# Altium project PiMX8MP_r0.3_release.PrjPcb (part 4 of 6)

## Sheet 11_WIFI_BLE_Module.SchDoc: WIFI_BLE_Module
size 420 x 297 mm; Author: Lukas Henkel; DocumentNumber: 11; SheetNumber: 11; SheetTotal: 16; DocSize: A3
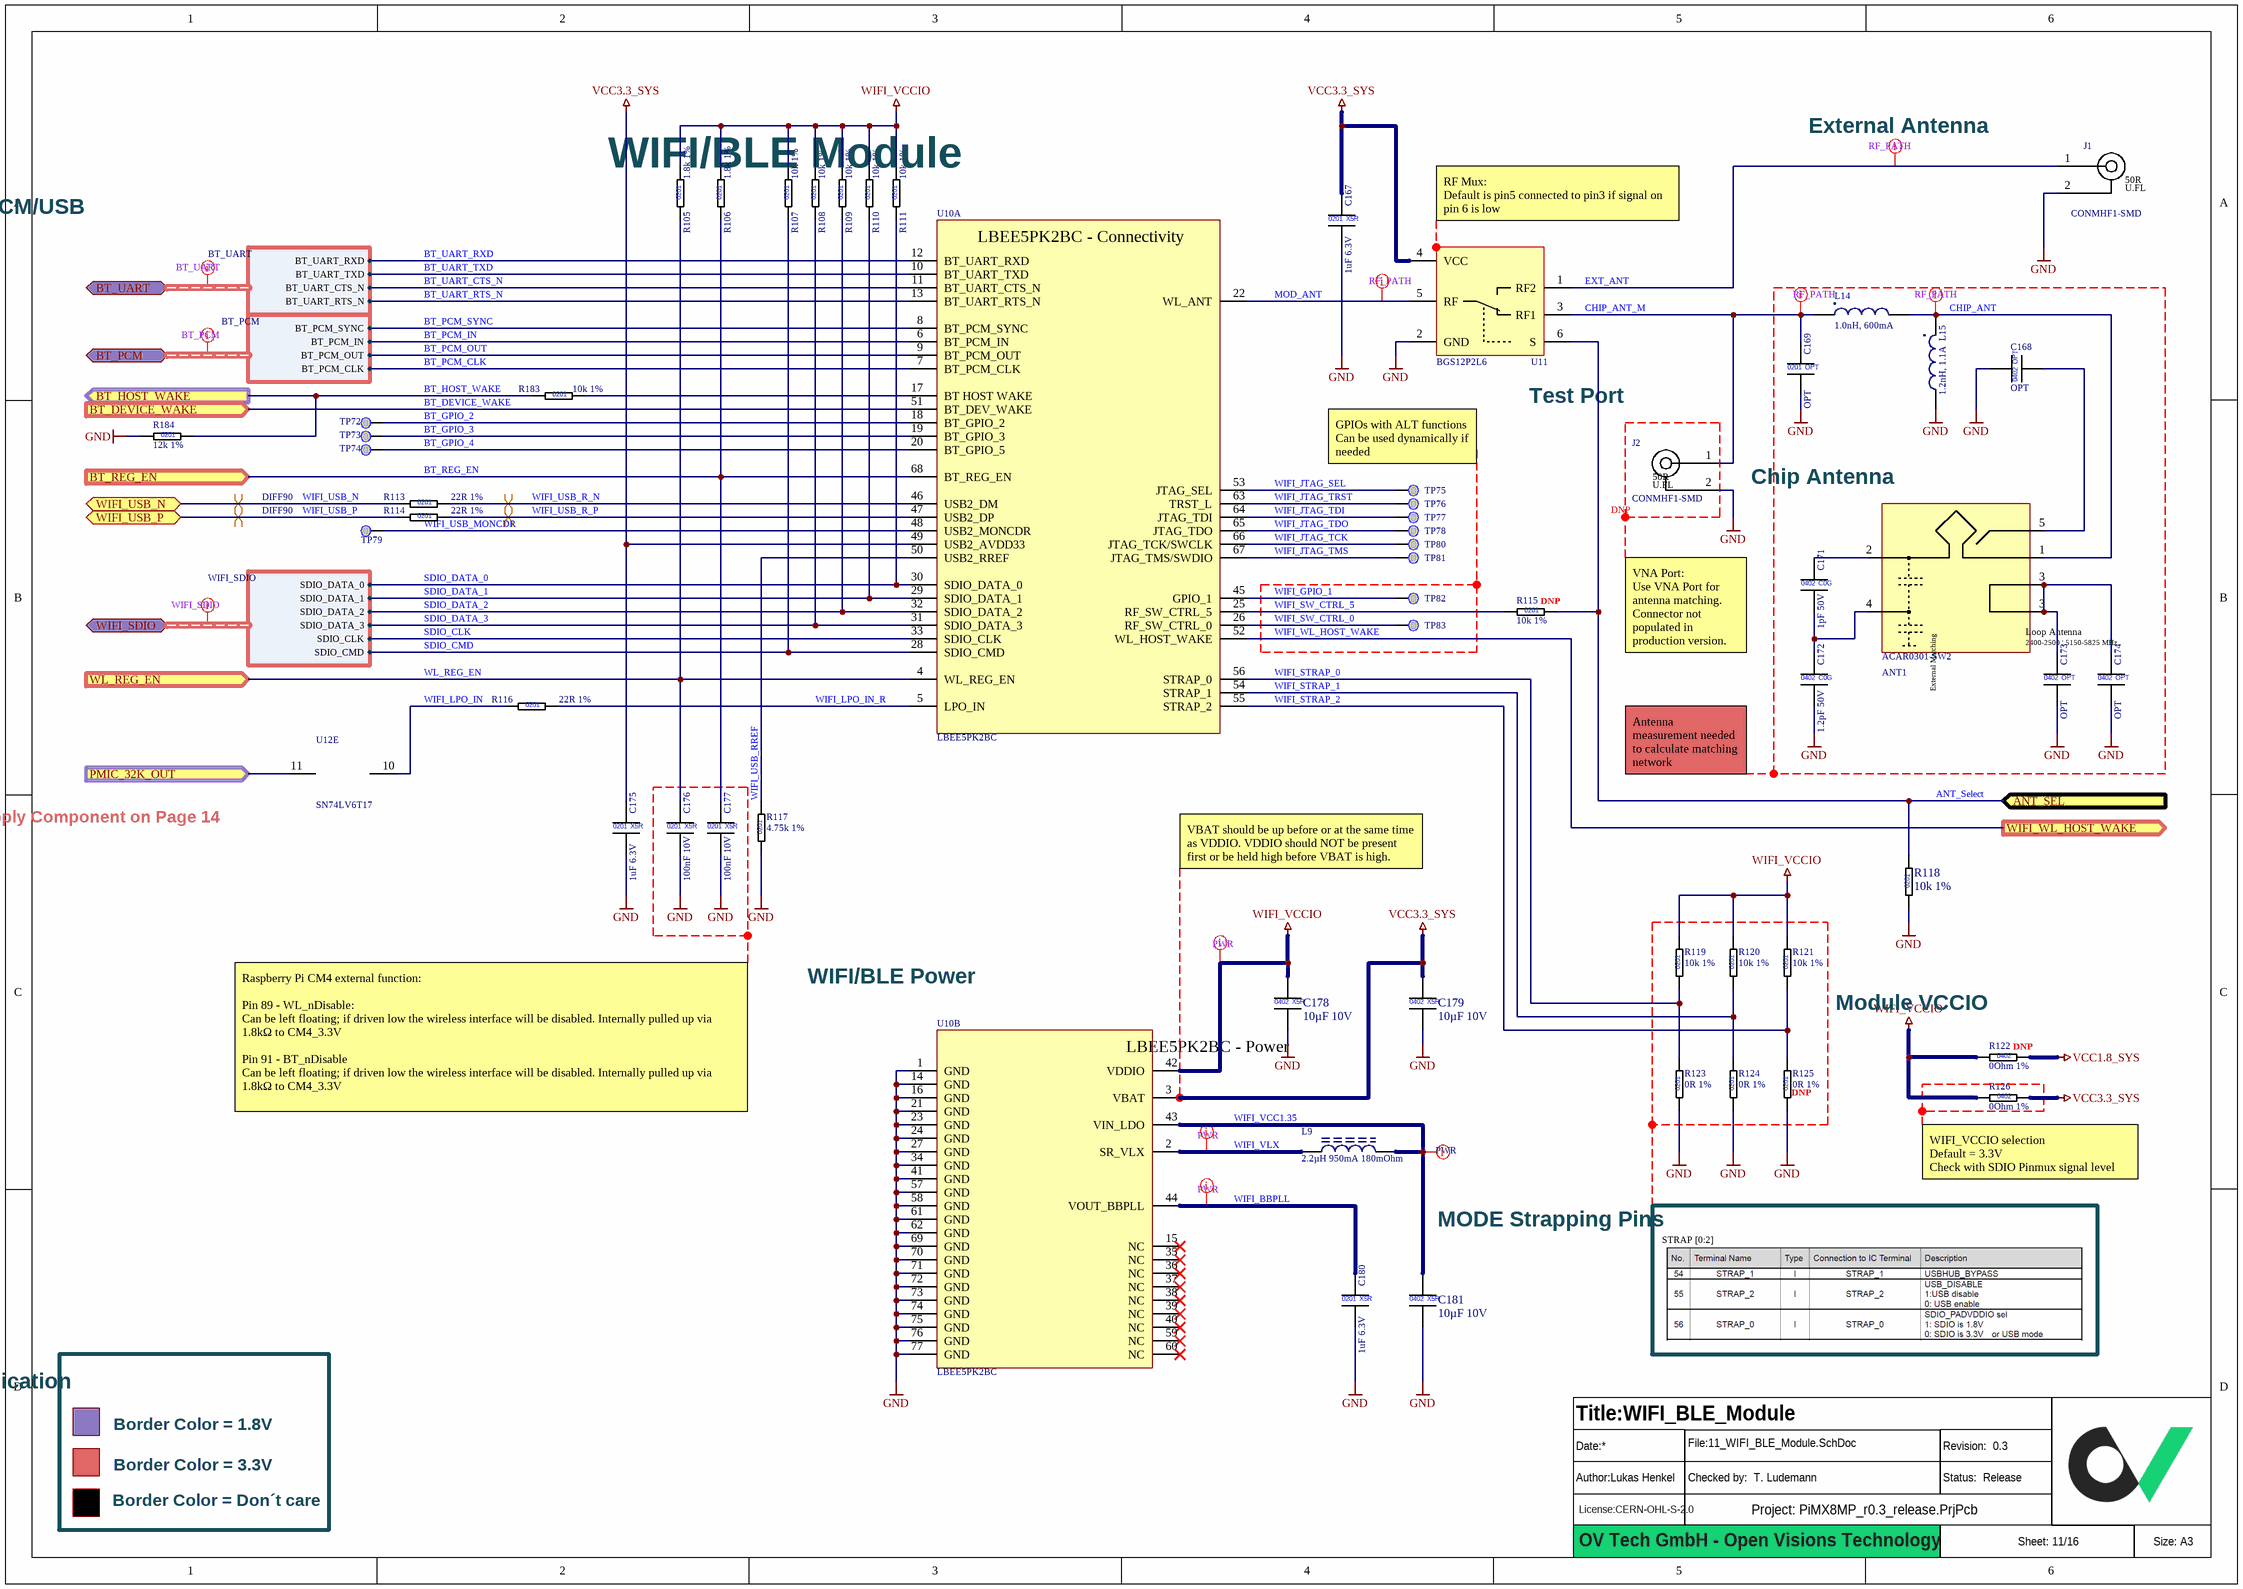
[diagram p11: 11_WIFI_BLE_Module.SchDoc]

### Parts
(Parts that share a designator on the sheet are numbered #1, #2 ... from top to bottom, then left to right.)
?#11  (no value)  (graphical)
ANT1  ACAR0301-SW2  [ANTENNA_ACAR0301-SW2]
C167  1uF 6.3V  [CAPC0603X03L]
C168  OPT  [CAPC1005X06L]  (no BOM)
C169  OPT  [CAPC0603X03L]  (no BOM)
C171  1pF 50V  [CAPC1005X06L]
C172  1.2pF 50V  [CAPC1005X06L]
C173  OPT  [CAPC1005X06L]  (no BOM)
C174  OPT  [CAPC1005X06L]  (no BOM)
C175  1uF 6.3V  [CAPC0603X03L]
C176  100nF 10V  [CAPC0603X03L]
C177  100nF 10V  [CAPC0603X03L]
C178  10µF 10V  [CAPC1005X06L]
C179  10µF 10V  [CAPC1005X06L]
C180  1uF 6.3V  [CAPC0603X03L]
C181  10µF 10V  [CAPC1005X06L]
J1  CONMHF1-SMD  [U.FL Jack SMD]
J2  CONMHF1-SMD  [U.FL Jack SMD]  (no BOM)
L9  2.2µH 950mA 180mOhm  [INDC2012X10L]
L14  1.0nH, 600mA  [INDC0603X03L]
L15  1.2nH, 1.1A  [INDC0603X03L]
R105  1.8k 1%  [RESC0603X03L]
R106  1.8k 1%  [RESC0603X03L]
R107  10k 1%  [RESC0603X03L]
R108  10k 1%  [RESC0603X03L]
R109  10k 1%  [RESC0603X03L]
R110  10k 1%  [RESC0603X03L]
R111  10k 1%  [RESC0603X03L]
R113  22R 1%  [RESC0603X03L]
R114  22R 1%  [RESC0603X03L]
R115  10k 1%  [RESC0603X03L]
R116  22R 1%  [RESC0603X03L]
R117  4.75k 1%  [RESC0603X03L]
R118  10k 1%  [RESC0603X03L]
R119  10k 1%  [RESC0603X03L]
R120  10k 1%  [RESC0603X03L]
R121  10k 1%  [RESC0603X03L]
R122  0Ohm 1%  [RESC1005X04L]
R123  0R 1%  [RESC0603X03L]
R124  0R 1%  [RESC0603X03L]
R125  0R 1%  [RESC0603X03L]
R126  0Ohm 1%  [RESC1005X04L]
R183  10k 1%  [RESC0603X03L]
R184  12k 1%  [RESC0603X03L]
TP72  Testpoint 0.5mm  [TP_0.50mm]  (value not drawn)  (no BOM)
TP73  Testpoint 0.5mm  [TP_0.50mm]  (value not drawn)  (no BOM)
TP74  Testpoint 0.5mm  [TP_0.50mm]  (value not drawn)  (no BOM)
TP75  Testpoint 0.5mm  [TP_0.50mm]  (value not drawn)  (no BOM)
TP76  Testpoint 0.5mm  [TP_0.50mm]  (value not drawn)  (no BOM)
TP77  Testpoint 0.5mm  [TP_0.50mm]  (value not drawn)  (no BOM)
TP78  Testpoint 0.5mm  [TP_0.50mm]  (value not drawn)  (no BOM)
TP79  Testpoint 0.5mm  [TP_0.50mm]  (value not drawn)  (no BOM)
TP80  Testpoint 0.5mm  [TP_0.50mm]  (value not drawn)  (no BOM)
TP81  Testpoint 0.5mm  [TP_0.50mm]  (value not drawn)  (no BOM)
TP82  Testpoint 0.5mm  [TP_0.50mm]  (value not drawn)  (no BOM)
TP83  Testpoint 0.5mm  [TP_0.50mm]  (value not drawn)  (no BOM)
U10  LBEE5PK2BC  [WIFI-BLE Module_LBEE5PK2BC]  (parts A,B of 2)
U11  BGS12P2L6  [PSON40P70X32-6N]
U12  SN74LV6T17  [QFN50P250X300X80_HS-13L]  (part E of 7)

### Blocks framed on the sheet
Chip Antenna: ANT1 C168 C169 C171-C174 L14 L15
DNP: J2
DNP: R119-R121 R123-R125

### Ports
ANT_SEL (in), BT_DEVICE_WAKE (in), BT_HOST_WAKE (out), BT_PCM (bidir, harness BT_PCM), BT_REG_EN (in), BT_UART (bidir, harness BT_UART), PMIC_32K_OUT (in), WIFI_SDIO (bidir, harness WIFI_SDIO), WIFI_USB_N (bidir), WIFI_USB_P (bidir), WIFI_WL_HOST_WAKE (out), WL_REG_EN (in)

### Harnesses
BT_UART: BT_UART_TXD, BT_UART_RXD, BT_UART_RTS_N, BT_UART_CTS_N
BT_PCM: BT_PCM_SYNC, BT_PCM_IN, BT_PCM_OUT, BT_PCM_CLK
WIFI_SDIO: SDIO_DATA_1, SDIO_DATA_0, SDIO_DATA_3, SDIO_DATA_2, SDIO_CMD, SDIO_CLK

### Nets
GND: C167.2 C168.1 C169.2 C172.2 C173.2 C174.2 C175.2 C176.2 C177.2 C178.2 C179.2 C180.2 C181.2 J1.2 J2.2 L15.2 R117.1 R118.1 R123.1 R124.1 R125.1 R184.1 U10.1(GND) U10.14(GND) U10.16(GND) U10.21(GND) U10.23(GND) U10.24(GND) U10.27(GND) U10.34(GND) U10.41(GND) U10.57(GND) U10.58(GND) U10.61(GND) U10.62(GND) U10.69(GND) U10.70(GND) U10.71(GND) U10.72(GND) U10.73(GND) U10.74(GND) U10.75(GND) U10.76(GND) U10.77(GND) U11.2(GND)
VCC1.8_SYS: R122.2
VCC3.3_SYS: C167.1 C175.1 C179.1 R126.2 U10.3(VBAT) U10.49(USB2_AVDD33) U11.4(VCC)
WIFI_VCCIO: C178.1 R105.2 R106.2 R107.2 R108.2 R109.2 R110.2 R111.2 R119.2 R120.2 R121.2 R122.1 R126.1 U10.42(VDDIO)
ANT_Select: R115.2 R118.2 U11.6(S) ; port ANT_SEL  [project net ANT_SEL]
BT_DEVICE_WAKE: U10.51(BT_DEV_WAKE) ; port BT_DEVICE_WAKE
BT_GPIO_2: TP72.TP U10.18(BT_GPIO_2)
BT_GPIO_3: TP73.TP U10.19(BT_GPIO_3)
BT_GPIO_4: TP74.TP U10.20(BT_GPIO_5)
BT_HOST_WAKE: R183.1 R184.2 ; port BT_HOST_WAKE
BT_PCM_CLK: U10.7(BT_PCM_CLK) ; port BT_PCM.BT_PCM_CLK
BT_PCM_IN: U10.6(BT_PCM_IN) ; port BT_PCM.BT_PCM_IN
BT_PCM_OUT: U10.9(BT_PCM_OUT) ; port BT_PCM.BT_PCM_OUT
BT_PCM_SYNC: U10.8(BT_PCM_SYNC) ; port BT_PCM.BT_PCM_SYNC
BT_REG_EN: C177.1 R106.1 U10.68(BT_REG_EN) ; port BT_REG_EN
BT_UART_CTS_N: U10.11(BT_UART_CTS_N) ; port BT_UART.BT_UART_CTS_N
BT_UART_RTS_N: U10.13(BT_UART_RTS_N) ; port BT_UART.BT_UART_RTS_N
BT_UART_RXD: U10.12(BT_UART_RXD) ; port BT_UART.BT_UART_RXD
BT_UART_TXD: U10.10(BT_UART_TXD) ; port BT_UART.BT_UART_TXD
CHIP_ANT: ANT1.1 L14.2 L15.1
CHIP_ANT_M: C169.1 J2.1 L14.1 U11.3(RF1)
EXT_ANT: J1.1 U11.1(RF2)
MOD_ANT: U10.22(WL_ANT) U11.5(RF)
PMIC_32K_OUT: U12.11(5A) ; port PMIC_32K_OUT
SDIO_CLK: U10.33(SDIO_CLK) ; port WIFI_SDIO.SDIO_CLK
SDIO_CMD: R107.1 U10.28(SDIO_CMD) ; port WIFI_SDIO.SDIO_CMD
SDIO_DATA_0: R111.1 U10.30(SDIO_DATA_0) ; port WIFI_SDIO.SDIO_DATA_0
SDIO_DATA_1: R110.1 U10.29(SDIO_DATA_1) ; port WIFI_SDIO.SDIO_DATA_1
SDIO_DATA_2: R109.1 U10.32(SDIO_DATA_2) ; port WIFI_SDIO.SDIO_DATA_2
SDIO_DATA_3: R108.1 U10.31(SDIO_DATA_3) ; port WIFI_SDIO.SDIO_DATA_3
WIFI_BBPLL: C180.1 U10.44(VOUT_BBPLL)
WIFI_GPIO_1: TP82.TP U10.45(GPIO_1)
WIFI_JTAG_SEL: TP75.TP U10.53(JTAG_SEL)
WIFI_JTAG_TCK: TP80.TP U10.66(JTAG_TCK/SWCLK)
WIFI_JTAG_TDI: TP77.TP U10.64(JTAG_TDI)
WIFI_JTAG_TDO: TP78.TP U10.65(JTAG_TDO)
WIFI_JTAG_TMS: TP81.TP U10.67(JTAG_TMS/SWDIO)
WIFI_JTAG_TRST: TP76.TP U10.63(TRST_L)
WIFI_LPO_IN: R116.1 U12.10(5Y)
WIFI_LPO_IN_R: R116.2 U10.5(LPO_IN)
WIFI_STRAP_0: R119.1 R123.2 U10.56(STRAP_0)
WIFI_STRAP_1: R120.1 R124.2 U10.54(STRAP_1)
WIFI_STRAP_2: R121.1 R125.2 U10.55(STRAP_2)
WIFI_SW_CTRL_0: TP83.TP U10.26(RF_SW_CTRL_0)
WIFI_SW_CTRL_5: R115.1 U10.25(RF_SW_CTRL_5)
WIFI_USB_MONCDR: TP79.TP U10.48(USB2_MONCDR)
WIFI_USB_N: R113.1 ; port WIFI_USB_N
WIFI_USB_P: R114.1 ; port WIFI_USB_P
WIFI_USB_R_N: R113.2 U10.46(USB2_DM)
WIFI_USB_R_P: R114.2 U10.47(USB2_DP)
WIFI_USB_RREF: R117.2 U10.50(USB2_RREF)
WIFI_VCC1.35: C181.1 L9.2 U10.43(VIN_LDO)
WIFI_VLX: L9.1 U10.2(SR_VLX)
WIFI_WL_HOST_WAKE: U10.52(WL_HOST_WAKE) ; port WIFI_WL_HOST_WAKE
WL_REG_EN: C176.1 R105.1 U10.4(WL_REG_EN) ; port WL_REG_EN
NetANT1_2: ANT1.2 C171.1
NetANT1_3: ANT1.3 C173.1 C174.1
NetANT1_4: ANT1.4 C171.2 C172.1
NetANT1_5: ANT1.5 C168.2
NetR183_2: R183.2 U10.17(BT_HOST_WAKE)

Not connected (* = marked no-connect by the designer): U10 15(NC)* 35(NC)* 36(NC)* 37(NC)* 38(NC)* 39(NC)* 40(NC)* 59(NC)* 60(NC)*

### Layout directives
net class RF_PATH: CHIP_ANT, CHIP_ANT_M, EXT_ANT, MOD_ANT
net class PWR: WIFI_BBPLL, WIFI_VCC1.35, WIFI_VCCIO, WIFI_VLX
differential pair; differential pair class DIFF90: WIFI_USB_N, WIFI_USB_P, WIFI_USB_R_N, WIFI_USB_R_P
net class BT_UART: (no net found under the mark)
net class BT_PCM: (no net found under the mark)
net class WIFI_SDIO: (no net found under the mark)

### Notes on the sheet
- (near J1) External Antenna
- WIFI/BLE Module
- UART/SDIO/PCM/USB
- (near U11) RF Mux:
  Default is pin5 connected to pin3 if signal on pin 6 is low
- Test Port
- GPIOs with ALT functions
  Can be used dynamically if needed
- (near R115) DNP
- VNA Port:
  Use VNA Port for antenna matching. Connector not populated in production version.
- Antenna measurement needed to calculate matching network
- (near U12) Supply Component on Page 14
- VBAT should be up before or at the same time as VDDIO. VDDIO should NOT be present first or be held high before VBAT is high.
- WIFI/BLE Power
- (near R122) Module VCCIO
- (near R122) DNP
- Raspberry Pi CM4 external function:
  Pin 89 - WL_nDisable:
  Can be left floating; if driven low the wireless interface will be disabled. Internally pulled up via 1.8kΩ to CM4_3.3V
  Pin 91 - BT_nDisable
  Can be left floating; if driven low the wireless interface will be disabled. Internally pulled up via 1.8kΩ to CM4_3.3V
- (near R126) WIFI_VCCIO selection
  Default = 3.3V
  Check with SDIO Pinmux signal level
- MODE Strapping Pins
- STRAP [0:2]
- Signal Level Indication
- Border Color = 1.8V
- Border Color = 3.3V
- Border Color = Don´t care
- OV Tech GmbH - Open Visions Technology
- (in symbol CAP_0201_1uF_6.3V) 0201; X5R
- (in symbol CAP_0201_100nF_10V) 0201; X5R
- (in symbol CAP_0201_OPT) 0201
- (in symbol CAP_0402_1.2pF_50V) 0402; C0G
- (in symbol CAP_0402_1pF_50V) 0402; C0G
- (in symbol CAP_0402_10µ_10V) 0402; X5R
- (in symbol CAP_0402_OPT) 0402
- (in symbol Chip Antenna_ACAR0301-SW2) External Matching; Loop Antenna; 2400-2500 | 5150-5825 MHz
- (in symbol RES_0201_0R_1%) 0201
- (in symbol RES_0201_1.8k_1%) 0201
- (in symbol RES_0201_4.75k_1%) 0201
- (in symbol RES_0201_10k_1%) 0201
- (in symbol RES_0201_12k_1%) 0201
- (in symbol RES_0201_22R_1%) 0201
- (in symbol RES_0402_0R_1%) 0402
- (in symbol U.FL_CONMHF1-SMD) 50R; U.FL
- (in symbol WIFI_BLE_Module_LBEE5PK2BC, part A) LBEE5PK2BC - Connectivity
- (in symbol WIFI_BLE_Module_LBEE5PK2BC, part B) LBEE5PK2BC - Power

### Library data of the parts
?#11 = Titleblock_01_OpenSource
ANT1 = Chip Antenna_ACAR0301-SW2: Ceramic Chip Antenna ACAR0301-SW2 2.4 - 5.825GHZ; Manufacturer 1: ABRACON; Manufacturer 1 Prt. Nr.: ACAR0301-SW2
C167 C175 C180 = CAP_0201_1uF_6.3V: Multilayer Ceramic Capacitors MLCC - SMD/SMT 0201 6.3VDC; Manufacturer 1: Murata Electronics; Manufacturer 1 Prt. Nr.: GRM033R60J105MEA2D; Manufacturer 2 Prt. Nr.: CL03A105MQ3CSNC; Manufacturer 2: Samsung Electro-Mechanics
C168 C173 C174 = CAP_0402_OPT: Optional Capacitor 0402
C169 = CAP_0201_OPT: Optional Capacitor 0201
C171 = CAP_0402_1pF_50V: Multilayer Ceramic Capacitors MLCC - SMD/SMT 0402 50VDC; Manufacturer 1: Murata Electronics; Manufacturer 1 Prt. Nr.: GJM1555C1H1R0BB01J; Manufacturer 2 Prt. Nr.: CBR04C109A5GAC; Manufacturer 2: KEMET
C172 = CAP_0402_1.2pF_50V: Multilayer Ceramic Capacitors MLCC - SMD/SMT 0402 50VDC; Manufacturer 1: Murata Electronics; Manufacturer 1 Prt. Nr.: GJM1555C1H1R2CB01D; Manufacturer 2 Prt. Nr.: CBR04C129A5GAC; Manufacturer 2: KEMET
C176 C177 = CAP_0201_100nF_10V: Multilayer Ceramic Capacitors MLCC - SMD/SMT 0201 10VDC; Manufacturer 1: Murata Electronics; Manufacturer 1 Prt. Nr.: GRT033R61A104KE01J; Manufacturer 2 Prt. Nr.: CL03A104MP3NNNC; Manufacturer 2: Samsung Electro-Mechanics
C178 C179 C181 = CAP_0402_10µ_10V: Multilayer Ceramic Capacitors MLCC - SMD/SMT 0402 10VDC; Manufacturer 1: Murata Electronics; Manufacturer 1 Prt. Nr.: GRM155R61A106ME11D; Manufacturer 2 Prt. Nr.: 0402ZD106MAT4A; Manufacturer 2: KYOCERA AVX
J1 J2 = U.FL_CONMHF1-SMD: U.FL Type Jack PCB SMD RF Connector; Manufacturer 1: Linx Technologies; Manufacturer 1 Prt. Nr.: CONMHF1-SMD
L9 = IND_LQM21_2.2µH_950mA: Fixed Inductors LQM21 2.2uH 950mA 20% 180mOhms; Manufacturer 1 Prt. Nr.: LQM21PN2R2MGSD; Manufacturer 1: Murata Electronics
L14 = HF_INDC_0201_1.0nH_600mA: 0201 HF Inductor; Manufacturer 1 Prt. Nr.: AIMC-06UHQ-1N0B-T; Manufacturer 1: Abracon; Manufacturer 2 Prt. Nr.: MLG0603S1N0BTD25; Manufacturer 2: TDK
L15 = HF_INDC_0201_1.2nH_1.1A: 0201 HF Inductor; Manufacturer 1 Prt. Nr.: AIMC-06UHQ-1N2B-T; Manufacturer 1: Abracon; Manufacturer 2 Prt. Nr.: LQP03HQ1N2C02D; Manufacturer 2: Murata
R105 R106 = RES_0201_1.8k_1%: Thick Film Resistors - SMD 1.8K OHM 1%; Manufacturer 1: Panasonic; Manufacturer 1 Prt. Nr.: ERJ-1GNF1801C; Manufacturer 2 Prt. Nr.: CRCW02011K80FKED; Manufacturer 2: Vishay / Dale
R107-R111 R115 R118-R121 R183 = RES_0201_10k_1%: Thick Film Resistors - SMD 10K OHM 1%; Manufacturer 1: Yageo; Manufacturer 1 Prt. Nr.: RC0201FR-0710KL; Manufacturer 2 Prt. Nr.: CRCW020110K0FNED; Manufacturer 2: Vishay / Dale
R113 R114 R116 = RES_0201_22R_1%: Thick Film Resistors - SMD 22R OHM 1%; Manufacturer 1: Yageo; Manufacturer 1 Prt. Nr.: RC0201FR-0722RL; Manufacturer 2 Prt. Nr.: CRCW020122R0FNED; Manufacturer 2: Vishay / Dale
R117 = RES_0201_4.75k_1%: Thick Film Resistors - SMD 4.75K OHM 1%; Manufacturer 1: Yageo; Manufacturer 1 Prt. Nr.: AC0201FR-074K75L; Manufacturer 2 Prt. Nr.: CRCW02014K75FNED; Manufacturer 2: Vishay / Dale
R122 R126 = RES_0402_0R_1%: Thick Film Resistors - SMD 0OHM 1%; Manufacturer 1: Bourns; Manufacturer 1 Prt. Nr.: CR0402AJ/-000GAS; Manufacturer 2 Prt. Nr.: AC0402FR-070RL; Manufacturer 2: YAGEO
R123-R125 = RES_0201_0R_1%: Thick Film Resistors - SMD 0R OHM 1%; Manufacturer 1: Yageo; Manufacturer 1 Prt. Nr.: RC0201FR-070RL; Manufacturer 2 Prt. Nr.: CRCW02010000Z0ED; Manufacturer 2: Vishay / Dale
R184 = RES_0201_12k_1%: Thick Film Resistors - SMD 12K OHM 1%; Manufacturer 1: Yageo; Manufacturer 1 Prt. Nr.: RC0201FR-0712KL; Manufacturer 2 Prt. Nr.: CRCW020112K0FKED; Manufacturer 2: Vishay / Dale
U10 = WIFI_BLE_Module_LBEE5PK2BC: Shielded Ultra Small Wi-Fi® 11a/b/g/n/ac + Bluetooth® 5.2 Module2.4GHz/5GHz Wi-Fi® + Bluetooth® Module; Manufacturer 1: Murata; Manufacturer 1 Prt. Nr.: LBEE5PK2BC; Temperature Range: -20°C - 70°C
U11 = RF Analog SW 2:1_BGS12P2L6: SPDT 2-channel analog multiplexer/demultiplexer EF 6GHz Bandwidth; Manufacturer 1: Infineon; Manufacturer 1 Prt. Nr.: BGS12P2L6E6327XTSA1
U12 = Hex_Schmitt-Buffer_LvL-Shift_SN74LV6T17: Hex Schmitt-Trigger Buffer with Integrated Translation; Manufacturer 1: NXP Semiconductors; Manufacturer 1 Prt. Nr.: SN74LV6T17BQAR

## Sheet 12_Coral_Edge_TPU.SchDoc: Coral Edge TPU
size 420 x 297 mm; Author: Lukas Henkel; DocumentNumber: 12; SheetNumber: 12; SheetTotal: 16; DocSize: A3
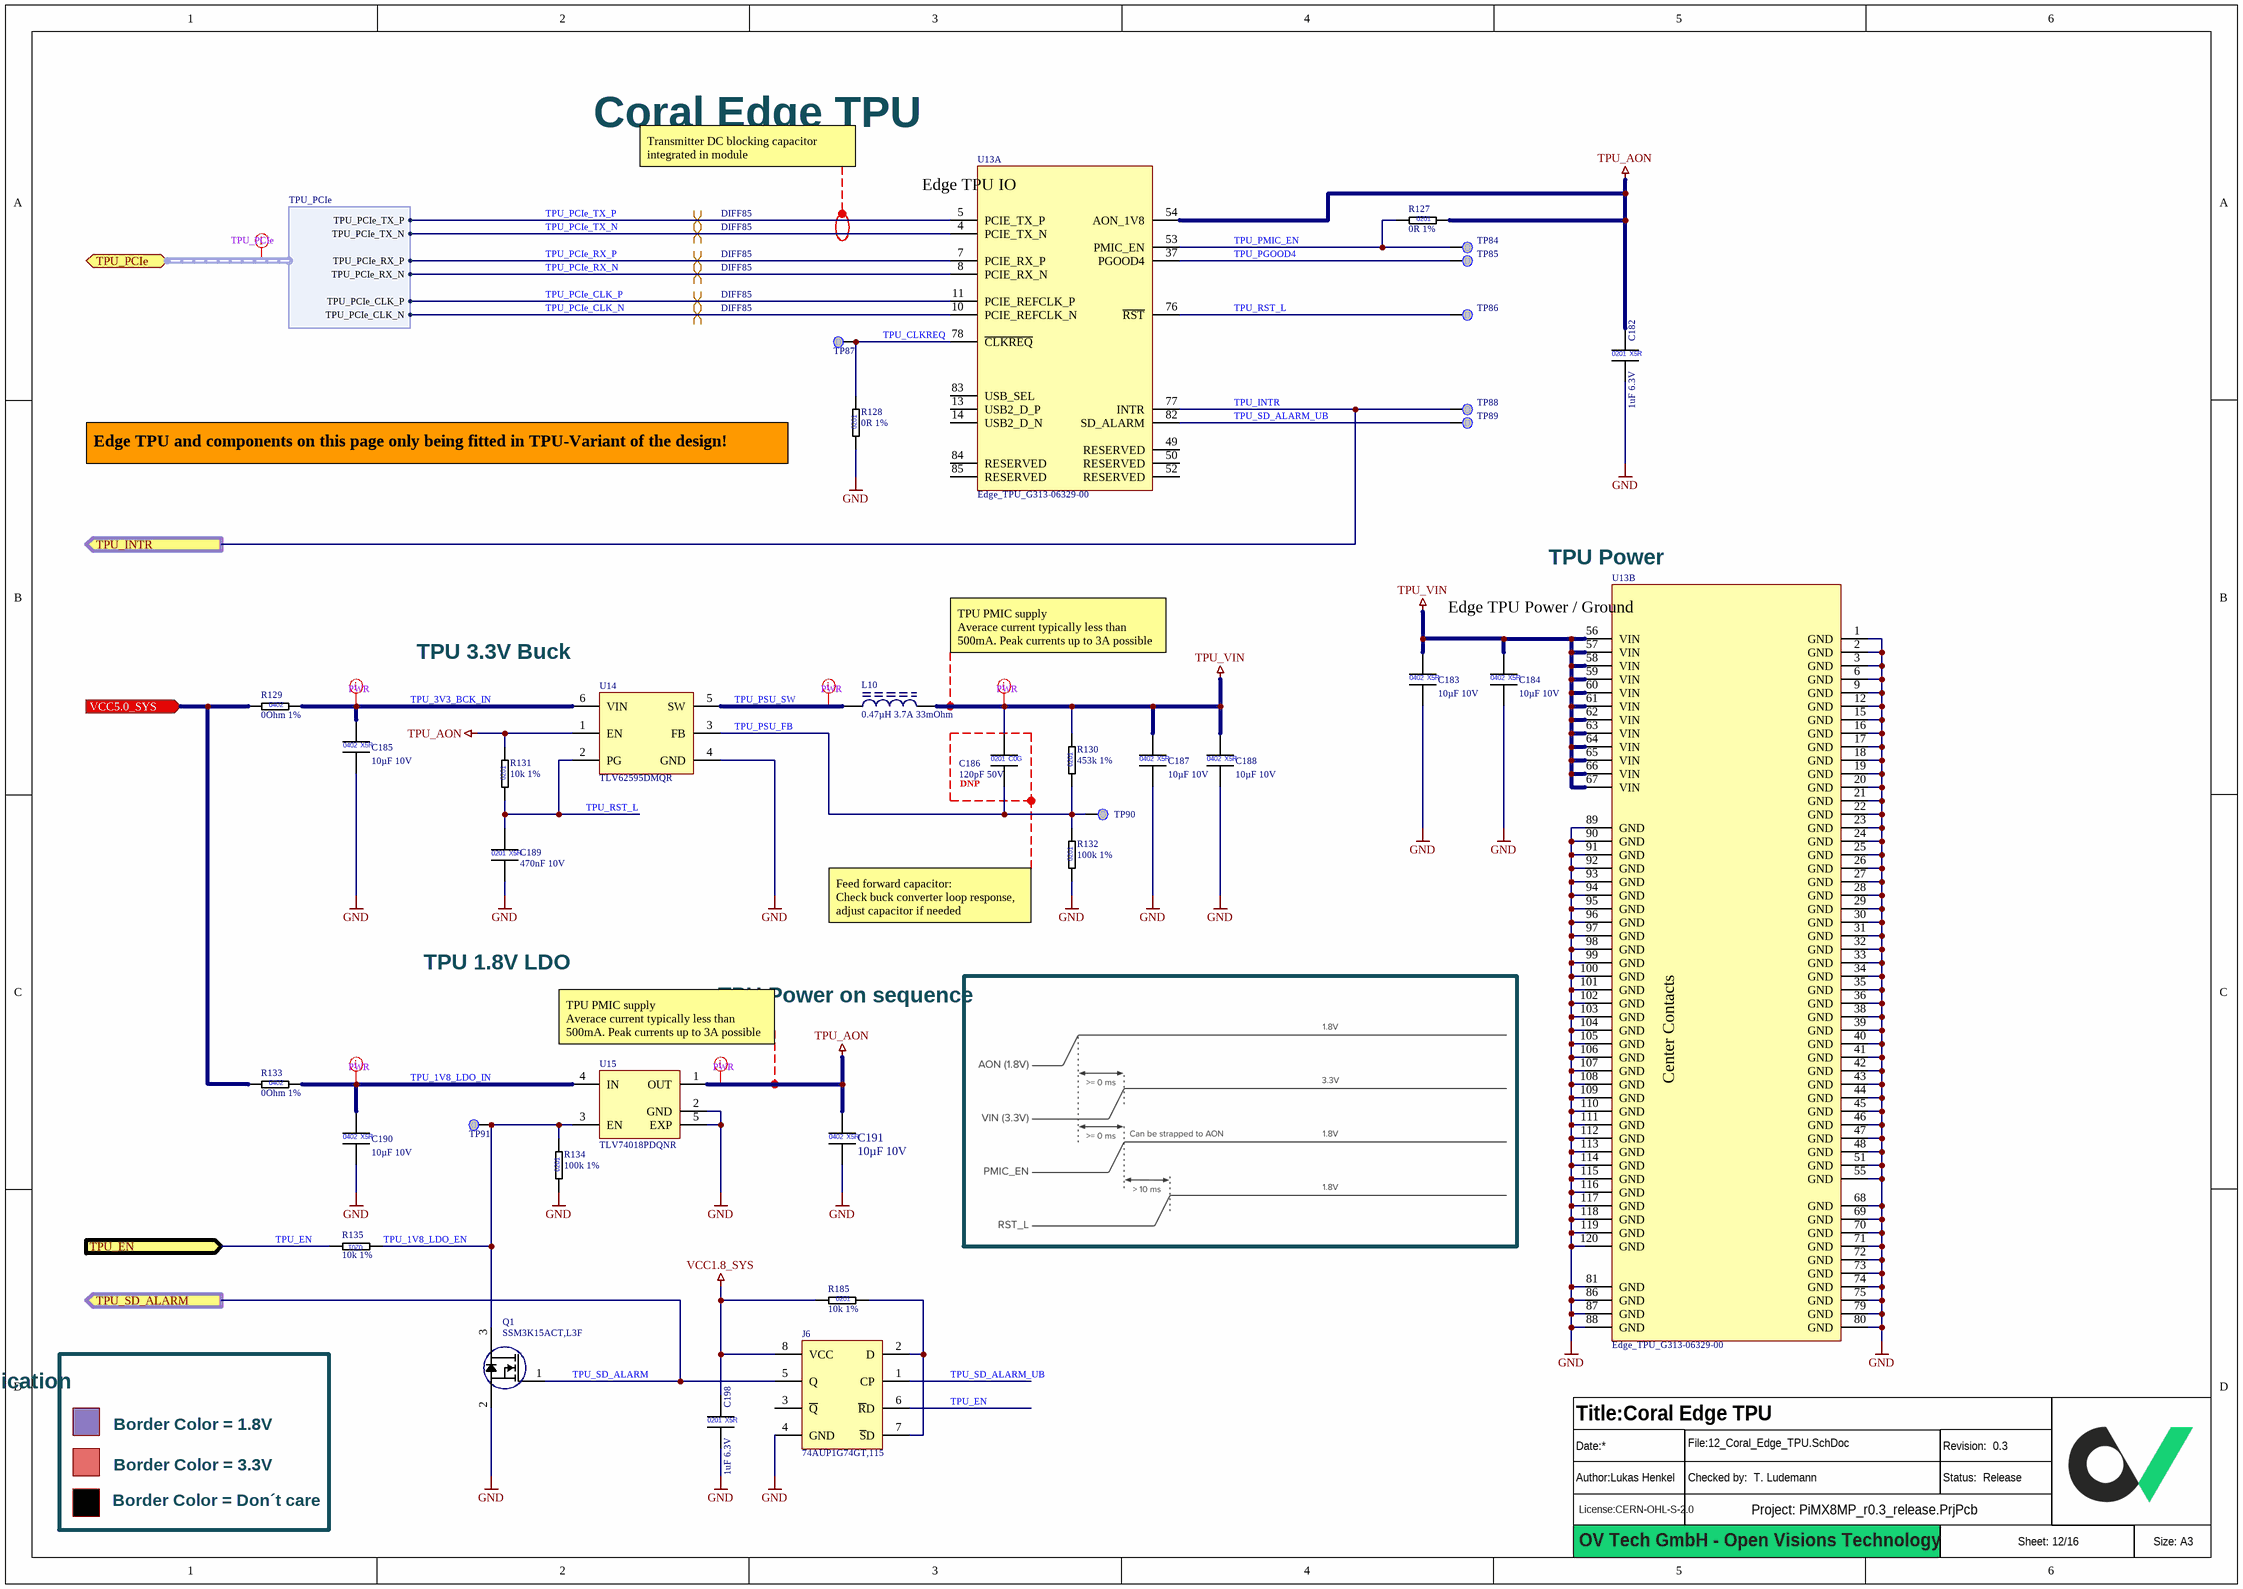
[diagram p12: 12_Coral_Edge_TPU.SchDoc]

### Parts
(Parts that share a designator on the sheet are numbered #1, #2 ... from top to bottom, then left to right.)
?#12  (no value)  (graphical)
C182  1uF 6.3V  [CAPC0603X03L]
C183  10µF 10V  [CAPC1005X06L]
C184  10µF 10V  [CAPC1005X06L]
C185  10µF 10V  [CAPC1005X06L]
C186  120pF 50V  [CAPC0603X03L]
C187  10µF 10V  [CAPC1005X06L]
C188  10µF 10V  [CAPC1005X06L]
C189  470nF 10V  [CAPC0603X03L]
C190  10µF 10V  [CAPC1005X06L]
C191  10µF 10V  [CAPC1005X06L]
C198  1uF 6.3V  [CAPC0603X03L]
J6  74AUP1G74GT,115  [PSON50P100X50-8L]
L10  0.47µH 3.7A 33mOhm  [INDC2016X12L]
Q1  SSM3K15ACT,L3F  [DFN65P100X50-3L]
R127  0R 1%  [RESC0603X03L]
R128  0R 1%  [RESC0603X03L]
R129  0Ohm 1%  [RESC1005X04L]
R130  453k 1%  [RESC0603X03L]
R131  10k 1%  [RESC0603X03L]
R132  100k 1%  [RESC0603X03L]
R133  0Ohm 1%  [RESC1005X04L]
R134  100k 1%  [RESC0603X03L]
R135  10k 1%  [RESC0603X03L]
R185  10k 1%  [RESC0603X03L]
TP84  Testpoint 0.5mm  [TP_0.50mm]  (value not drawn)  (no BOM)
TP85  Testpoint 0.5mm  [TP_0.50mm]  (value not drawn)  (no BOM)
TP86  Testpoint 0.5mm  [TP_0.50mm]  (value not drawn)  (no BOM)
TP87  Testpoint 0.5mm  [TP_0.50mm]  (value not drawn)  (no BOM)
TP88  Testpoint 0.5mm  [TP_0.50mm]  (value not drawn)  (no BOM)
TP89  Testpoint 0.5mm  [TP_0.50mm]  (value not drawn)  (no BOM)
TP90  Testpoint 0.5mm  [TP_0.50mm]  (value not drawn)  (no BOM)
TP91  Testpoint 0.5mm  [TP_0.50mm]  (value not drawn)  (no BOM)
U13  Edge_TPU_G313-06329-00  [LGA120C50P19X22_1000X1500X150]  (parts A,B of 2)
U14  TLV62595DMQR  [VSON50P150X150X100_HS-6L]
U15  TLV74018PDQNR  [X2SON-DFN]

### Blocks framed on the sheet
DNP: C186

### Ports
TPU_EN (in), TPU_INTR (out), TPU_PCIe (bidir, harness TPU_PCIe), TPU_SD_ALARM (out), VCC5.0_SYS (in)

### Harnesses
TPU_PCIe: TPU_PCIe_TX_P, TPU_PCIe_TX_N, TPU_PCIe_RX_P, TPU_PCIe_RX_N, TPU_PCIe_CLK_P, TPU_PCIe_CLK_N

### Nets
GND: C182.2 C183.2 C184.2 C185.2 C187.2 C188.2 C189.2 C190.2 C191.2 C198.2 J6.4(GND) Q1.2(S) R128.1 R132.1 R134.1 U13.1(GND) U13.2(GND) U13.3(GND) U13.6(GND) U13.9(GND) U13.12(GND) U13.15(GND) U13.16(GND) U13.17(GND) U13.18(GND) U13.19(GND) U13.20(GND) U13.21(GND) U13.22(GND) U13.23(GND) U13.24(GND) U13.25(GND) U13.26(GND) U13.27(GND) U13.28(GND) U13.29(GND) U13.30(GND) U13.31(GND) U13.32(GND) U13.33(GND) U13.34(GND) U13.35(GND) U13.36(GND) U13.38(GND) U13.39(GND) U13.40(GND) U13.41(GND) U13.42(GND) U13.43(GND) U13.44(GND) U13.45(GND) U13.46(GND) U13.47(GND) U13.48(GND) U13.51(GND) U13.55(GND) U13.68(GND) U13.69(GND) U13.70(GND) U13.71(GND) U13.72(GND) U13.73(GND) U13.74(GND) U13.75(GND) U13.79(GND) U13.80(GND) U13.81(GND) U13.86(GND) U13.87(GND) U13.88(GND) U13.89(GND) U13.90(GND) U13.91(GND) U13.92(GND) U13.93(GND) U13.94(GND) U13.95(GND) U13.96(GND) U13.97(GND) U13.98(GND) U13.99(GND) U13.100(GND) U13.101(GND) U13.102(GND) U13.103(GND) U13.104(GND) U13.105(GND) U13.106(GND) U13.107(GND) U13.108(GND) U13.109(GND) U13.110(GND) U13.111(GND) U13.112(GND) U13.113(GND) U13.114(GND) U13.115(GND) U13.116(GND) U13.117(GND) U13.118(GND) U13.119(GND) U13.120(GND) U14.4(GND) U15.2(GND) U15.5(EXP)
TPU_AON: C182.1 C191.1 R127.2 R131.2 U13.54(AON_1V8) U14.1(EN) U15.1(OUT)
TPU_VIN: C183.1 C184.1 C186.1 C187.1 C188.1 L10.2 R130.2 U13.56(VIN) U13.57(VIN) U13.58(VIN) U13.59(VIN) U13.60(VIN) U13.61(VIN) U13.62(VIN) U13.63(VIN) U13.64(VIN) U13.65(VIN) U13.66(VIN) U13.67(VIN)
VCC1.8_SYS: C198.1 J6.8(VCC) R185.1
TPU_1V8_LDO_EN: Q1.3(D) R134.2 R135.1 TP91.TP U15.3(EN)
TPU_1V8_LDO_IN: C190.1 R133.2 U15.4(IN)
TPU_3V3_BCK_IN: C185.1 R129.2 U14.6(VIN)
TPU_CLKREQ: R128.2 TP87.TP U13.78(~{CLKREQ})
TPU_EN: J6.6(~{R}D) R135.2 ; port TPU_EN
TPU_INTR: TP88.TP U13.77(INTR) ; port TPU_INTR
TPU_PCIe_CLK_N: U13.10(PCIE_REFCLK_N) ; port TPU_PCIe.TPU_PCIe_CLK_N
TPU_PCIe_CLK_P: U13.11(PCIE_REFCLK_P) ; port TPU_PCIe.TPU_PCIe_CLK_P
TPU_PCIe_RX_N: U13.8(PCIE_RX_N) ; port TPU_PCIe.TPU_PCIe_RX_N
TPU_PCIe_RX_P: U13.7(PCIE_RX_P) ; port TPU_PCIe.TPU_PCIe_RX_P
TPU_PCIe_TX_N: U13.4(PCIE_TX_N) ; port TPU_PCIe.TPU_PCIe_TX_N
TPU_PCIe_TX_P: U13.5(PCIE_TX_P) ; port TPU_PCIe.TPU_PCIe_TX_P
TPU_PGOOD4: TP85.TP U13.37(PGOOD4)
TPU_PMIC_EN: R127.1 TP84.TP U13.53(PMIC_EN)
TPU_PSU_FB: C186.2 R130.1 R132.2 TP90.TP U14.3(FB)
TPU_PSU_SW: L10.1 U14.5(SW)
TPU_RST_L: C189.1 R131.1 TP86.TP U13.76(~{RST}) U14.2(PG)
TPU_SD_ALARM: J6.5(Q) Q1.1(G) ; port TPU_SD_ALARM
TPU_SD_ALARM_UB: J6.1(CP) TP89.TP U13.82(SD_ALARM)
VCC5.0_SYS: R129.1 R133.1 ; port VCC5.0_SYS
NetJ6_2: J6.2(D) J6.7(~{S}D) R185.2

Not connected (* = marked no-connect by the designer): J6 3(~{Q}); U13 13(USB2_D_P) 14(USB2_D_N) 49(RESERVED) 50(RESERVED) 52(RESERVED) 83(USB_SEL) 84(RESERVED) 85(RESERVED)

### Layout directives
net class PWR: TPU_1V8_LDO_IN, TPU_3V3_BCK_IN, TPU_AON, TPU_PSU_SW, TPU_VIN
net class TPU_PCIe: (no net found under the mark)
differential pair; differential pair class DIFF85: TPU_PCIe_CLK_N, TPU_PCIe_CLK_P, TPU_PCIe_RX_N, TPU_PCIe_RX_P, TPU_PCIe_TX_N, TPU_PCIe_TX_P

### Notes on the sheet
- Coral Edge TPU
- Transmitter DC blocking capacitor integrated in module
- Edge TPU and components on this page only being fitted in TPU-Variant of the design!
- TPU Power
- (near U14) TPU 3.3V Buck
- TPU PMIC supply
  Averace current typically less than 500mA. Peak currents up to 3A possible
- (near R132) Feed forward capacitor:
  Check buck converter loop response, adjust capacitor if needed
- TPU 1.8V LDO
- TPU Power on sequence
- (near U15) TPU PMIC supply
  Averace current typically less than 500mA. Peak currents up to 3A possible
- Signal Level Indication
- Border Color = 1.8V
- Border Color = 3.3V
- Border Color = Don´t care
- OV Tech GmbH - Open Visions Technology
- (in symbol CAP_0201_1uF_6.3V) 0201; X5R
- (in symbol CAP_0201_120pF_50V) 0201; C0G
- (in symbol CAP_0201_470nF_10V) 0201; X5R
- (in symbol CAP_0402_10µ_10V) 0402; X5R
- (in symbol RES_0201_0R_1%) 0201
- (in symbol RES_0201_10k_1%) 0201
- (in symbol RES_0201_100k_1%) 0201
- (in symbol RES_0201_453k_1%) 0201
- (in symbol RES_0402_0R_1%) 0402
- (in symbol TPU_Google_Edge_TPU, part A) Edge TPU IO
- (in symbol TPU_Google_Edge_TPU, part B) Edge TPU Power / Ground; Center Contacts

### Library data of the parts
?#12 = Titleblock_01_OpenSource
C182 C198 = CAP_0201_1uF_6.3V: as C167 on sheet 11_WIFI_BLE_Module; Manufacturer 2: Samsung Electro-Mechanics
C183-C185 C187 C188 C190 C191 = CAP_0402_10µ_10V: as C178 on sheet 11_WIFI_BLE_Module; Manufacturer 2: KYOCERA AVX
C186 = CAP_0201_120pF_50V: Multilayer Ceramic Capacitors MLCC - SMD/SMT 0201 50VDC; Manufacturer 1: Murata Electronics; Manufacturer 1 Prt. Nr.: GRT0335C1H121FA02D; Manufacturer 2 Prt. Nr.: GRM0335C1H121FA01D; Manufacturer 2: Murata Electronics
C189 = CAP_0201_470nF_10V: Multilayer Ceramic Capacitors MLCC - SMD/SMT 0201 10VDC; Manufacturer 1: Taiyo Yuden; Manufacturer 1 Prt. Nr.: LMK063BBJ474KPLF; Manufacturer 2 Prt. Nr.: C0603X5R1A474M030BC; Manufacturer 2: TDK
J6 = D-FLOP_SMG-W-2,0x1,2x1,25-AU: D-type flip-flop with differential output and async set- and reset input; Manufacturer 1: Nexperia; Manufacturer 1 Prt. Nr.: 74AUP1G74GT,115
L10 = IND_DFE-P 2016_0.47µH_3.7A: Fixed Inductors DFE-P 2016 0.47uH 3.7A 20% 33mOhms HiCur; Manufacturer 1 Prt. Nr.: DFE201612P-R47M=P2; Manufacturer 1: Murata Electronics
Q1 = N-Channel MOSFET_SSM3K15ACT,L3F: MOSFET 30V SGL N-CH TRENCHMOS Logic Level; Manufacturer 1: Toshiba; Manufacturer 1 Prt. Nr.: SSM3K15ACT,L3F
R127 R128 = RES_0201_0R_1%: as R123-R125 on sheet 11_WIFI_BLE_Module; Manufacturer 2: Vishay / Dale
R129 R133 = RES_0402_0R_1%: as R122 on sheet 11_WIFI_BLE_Module; Manufacturer 2: YAGEO
R130 = RES_0201_453k_1%: Thick Film Resistors - SMD 453K OHM 1%; Manufacturer 1: Yageo; Manufacturer 1 Prt. Nr.: RC0201FR-07453KL; Manufacturer 2 Prt. Nr.: CRCW0201453KFKED; Manufacturer 2: Vishay / Dale
R131 R135 R185 = RES_0201_10k_1%: as R107-R111 on sheet 11_WIFI_BLE_Module; Manufacturer 2: Vishay / Dale
R132 R134 = RES_0201_100k_1%: Thick Film Resistors - SMD 100K OHM 1%; Manufacturer 1: Yageo; Manufacturer 1 Prt. Nr.: RC0201FR-07100KL; Manufacturer 2 Prt. Nr.: CRCW0201100KFNED; Manufacturer 2: Vishay / Dale
U13 = TPU_Google_Edge_TPU: Google Coral accelerator module, 4TOPs peak performace, PCIe Gen 2x1 & USB2.0 HS; Manufacturer: Coral; Manufacturer Part Number: G313-06329-00
U14 = Buck 4A 5.5V_TLV62595DMQR: 5.5V, 4A, Adjustable ,Synchronous Buck Converter; Manufacturer 1: Texas Instruments; Manufacturer 1 Prt. Nr.: TLV62595DMQR
U15 = LDO 1.8V_TLV74018PDQNR: LDO voltage regulator 300mA X2SON; Manufacturer 1: Texas Instruments; Manufacturer 1 Prt. Nr.: TLV74018PDQNR

## Sheet 13_Interface_Options.SchDoc: Configuration and Assembly Options
size 420 x 297 mm; Author: Lukas Henkel; DocumentNumber: 13; SheetNumber: 13; SheetTotal: 16; DocSize: A3
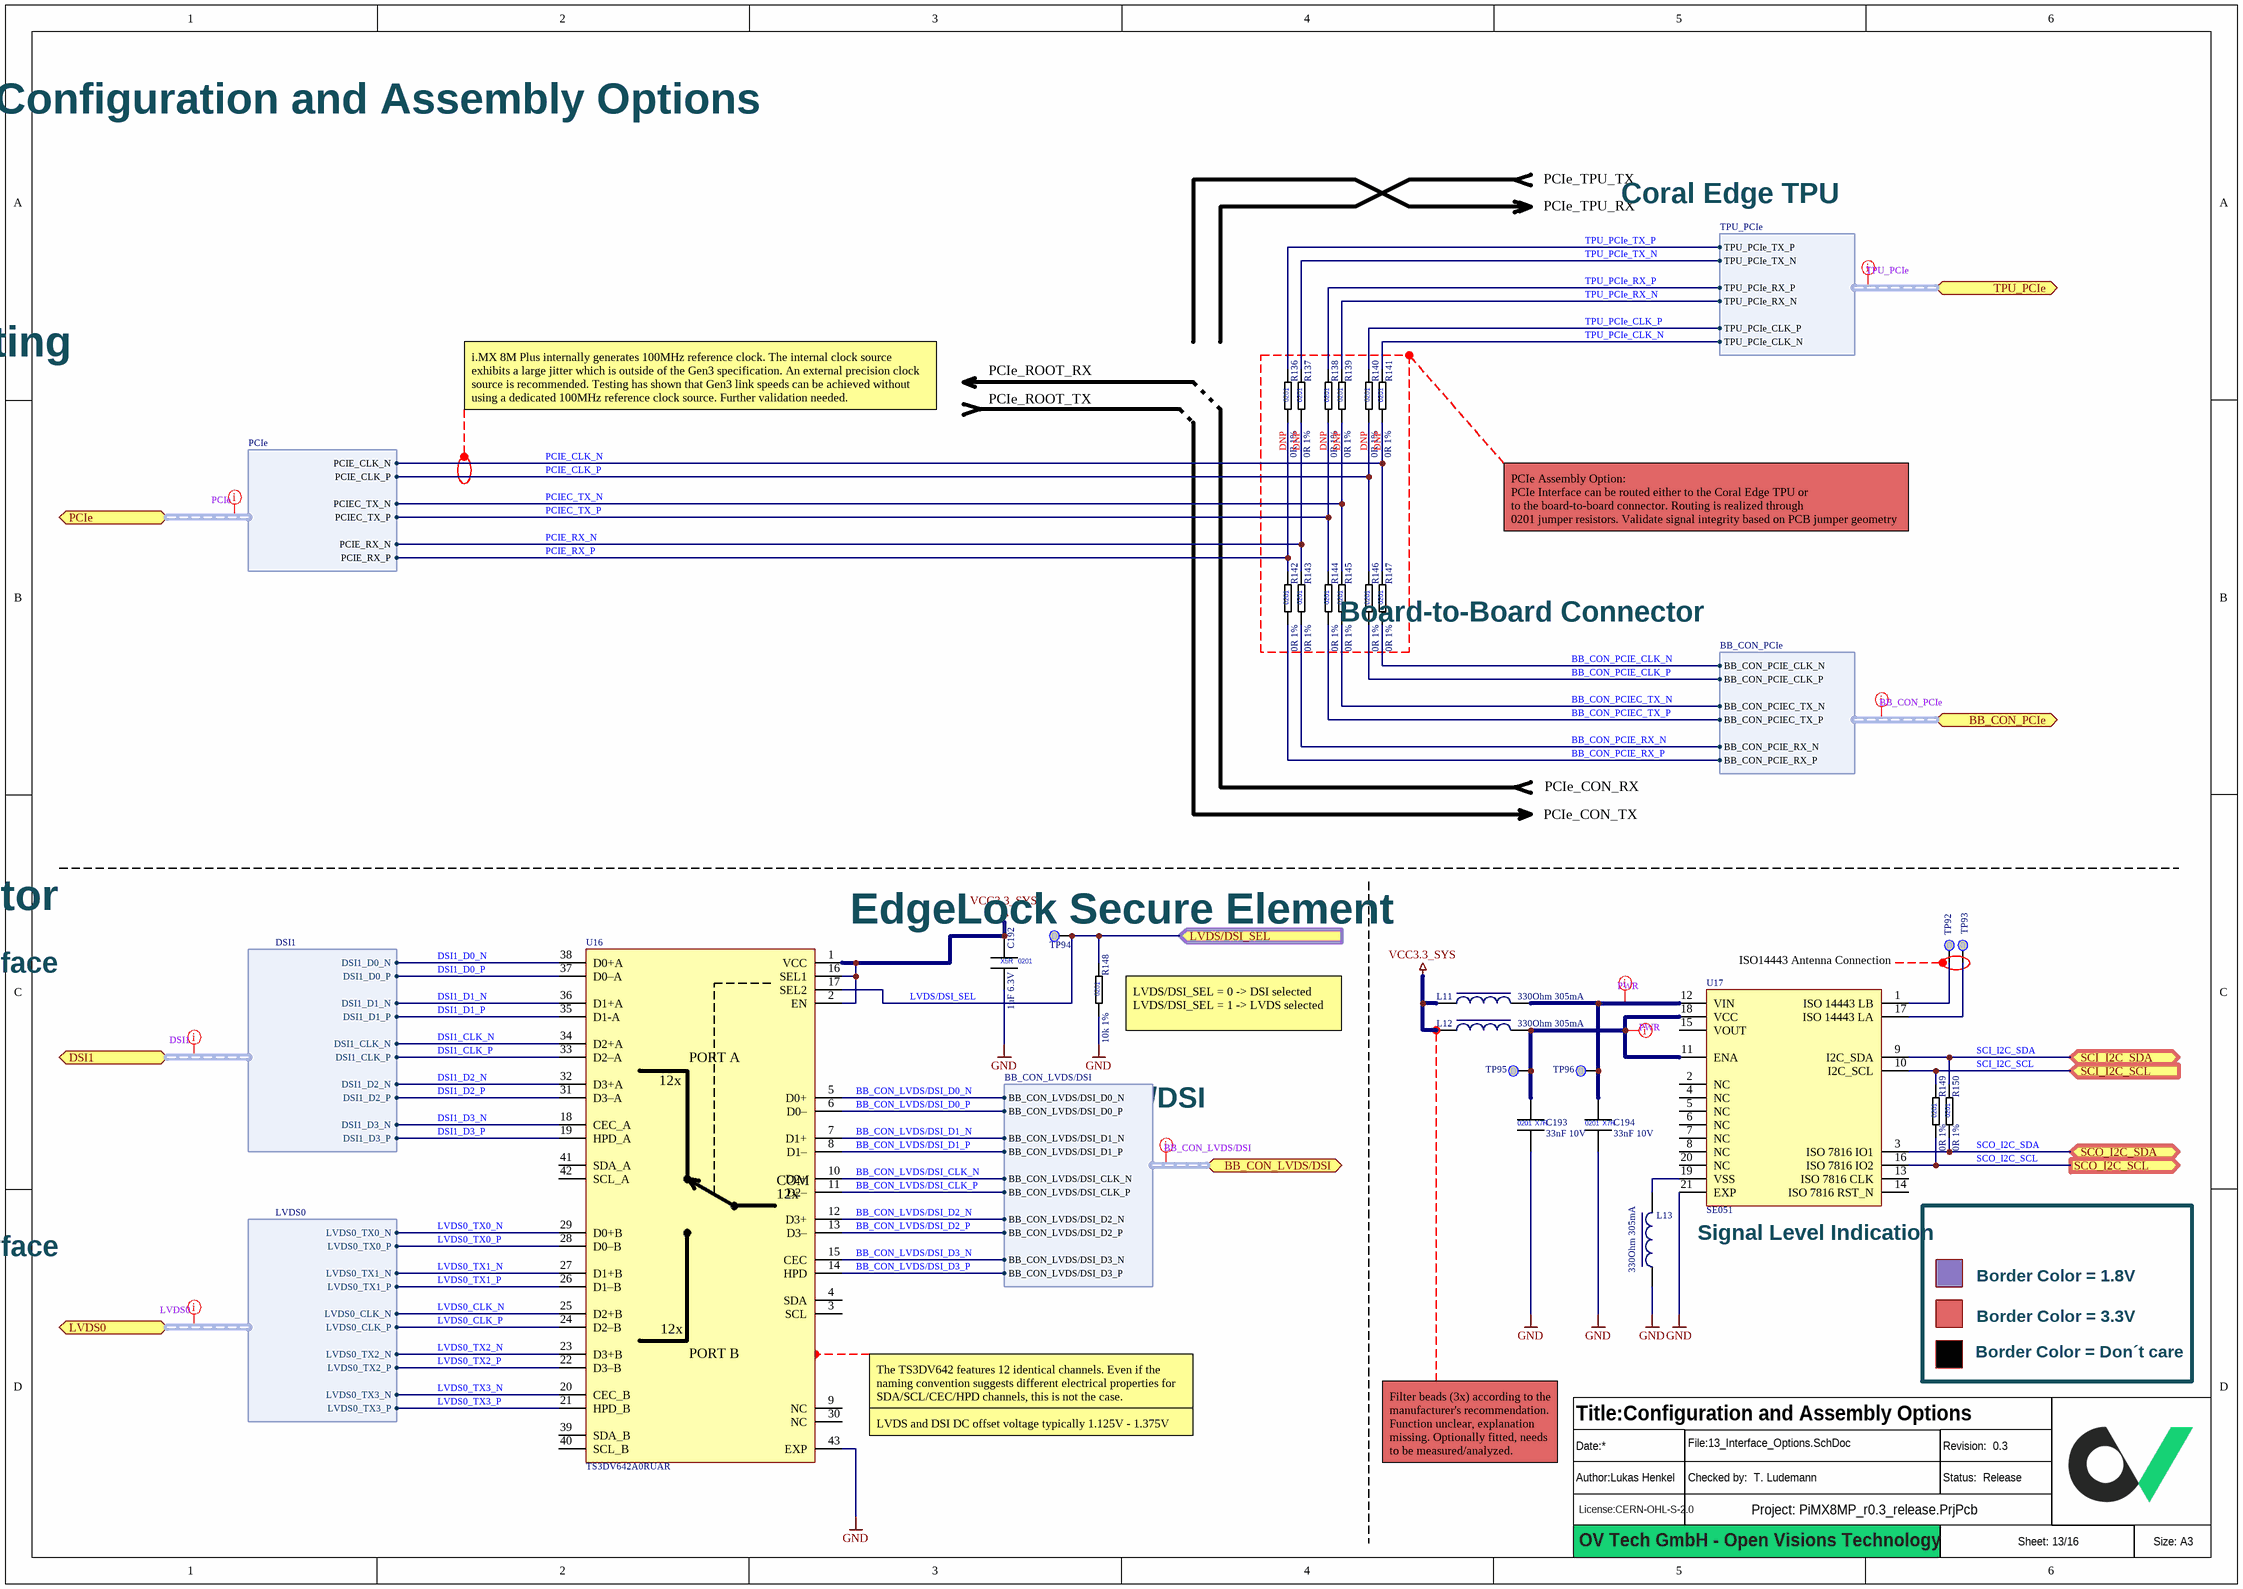
[diagram p13: 13_Interface_Options.SchDoc]

### Parts
(Parts that share a designator on the sheet are numbered #1, #2 ... from top to bottom, then left to right.)
?#13  (no value)  (graphical)
C192  1uF 6.3V  [CAPC0603X03L]
C193  33nF 10V  [CAPC0603X03L]
C194  33nF 10V  [CAPC0603X03L]
L11  330Ohm 305mA  [INDC0603X03L]
L12  330Ohm 305mA  [INDC0603X03L]
L13  330Ohm 305mA  [INDC0603X03L]
R136  0R 1%  [RESC0603X03L]
R137  0R 1%  [RESC0603X03L]
R138  0R 1%  [RESC0603X03L]
R139  0R 1%  [RESC0603X03L]
R140  0R 1%  [RESC0603X03L]
R141  0R 1%  [RESC0603X03L]
R142  0R 1%  [RESC0603X03L]
R143  0R 1%  [RESC0603X03L]
R144  0R 1%  [RESC0603X03L]
R145  0R 1%  [RESC0603X03L]
R146  0R 1%  [RESC0603X03L]
R147  0R 1%  [RESC0603X03L]
R148  10k 1%  [RESC0603X03L]
R149  0R 1%  [RESC0603X03L]
R150  0R 1%  [RESC0603X03L]
TP92  Testpoint 0.75mm  [TP_0.75mm]  (value not drawn)  (no BOM)
TP93  Testpoint 0.75mm  [TP_0.75mm]  (value not drawn)  (no BOM)
TP94  Testpoint 0.5mm  [TP_0.50mm]  (value not drawn)  (no BOM)
TP95  Testpoint 0.5mm  [TP_0.50mm]  (value not drawn)  (no BOM)
TP96  Testpoint 0.5mm  [TP_0.50mm]  (value not drawn)  (no BOM)
U16  TS3DV642A0RUAR  [QFN50P350X900X80_HS-43L]
U17  SE051  [QFN40P300X300X33_HS-21L]

### Ports
BB_CON_LVDS/DSI (bidir, harness BB_CON_LVDS/DSI), BB_CON_PCIe (bidir, harness BB_CON_PCIe), DSI1 (bidir, harness DSI1), LVDS0 (bidir, harness LVDS0), LVDS/DSI_SEL (in), PCIe (bidir, harness PCIe), SCI_I2C_SCL (in), SCI_I2C_SDA (bidir), SCO_I2C_SCL (out), SCO_I2C_SDA (bidir), TPU_PCIe (bidir, harness TPU_PCIe)

### Harnesses
PCIe: PCIE_CLK_N, PCIE_CLK_P, PCIEC_TX_N, PCIE_RX_P, PCIE_RX_N, PCIEC_TX_P
TPU_PCIe: TPU_PCIe_TX_P, TPU_PCIe_TX_N, TPU_PCIe_RX_P, TPU_PCIe_RX_N, TPU_PCIe_CLK_P, TPU_PCIe_CLK_N
BB_CON_PCIe: BB_CON_PCIE_CLK_N, BB_CON_PCIE_CLK_P, BB_CON_PCIEC_TX_N, BB_CON_PCIE_RX_P, BB_CON_PCIE_RX_N, BB_CON_PCIEC_TX_P
BB_CON_LVDS/DSI: BB_CON_LVDS/DSI_D0_P, BB_CON_LVDS/DSI_D0_N, BB_CON_LVDS/DSI_D1_P, BB_CON_LVDS/DSI_D1_N, BB_CON_LVDS/DSI_D2_P, BB_CON_LVDS/DSI_D2_N, BB_CON_LVDS/DSI_CLK_P, BB_CON_LVDS/DSI_CLK_N, BB_CON_LVDS/DSI_D3_P, BB_CON_LVDS/DSI_D3_N
DSI1: DSI1_CLK_N, DSI1_CLK_P, DSI1_D0_N, DSI1_D0_P, DSI1_D1_N, DSI1_D1_P, DSI1_D2_N, DSI1_D2_P, DSI1_D3_N, DSI1_D3_P
LVDS0: LVDS0_CLK_N, LVDS0_CLK_P, LVDS0_TX0_N, LVDS0_TX0_P, LVDS0_TX1_N, LVDS0_TX1_P, LVDS0_TX2_N, LVDS0_TX2_P, LVDS0_TX3_N, LVDS0_TX3_P

### Nets
GND: C192.2 C193.2 C194.2 L13.1 R148.1 U16.43(EXP) U17.21(EXP)
VCC3.3_SYS: C192.1 L11.1 L12.1 U16.1(VCC) U16.2(EN) U16.16(SEL1)
BB_CON_LVDS/DSI_CLK_N: U16.10(D2+) ; port BB_CON_LVDS/DSI.BB_CON_LVDS/DSI_CLK_N
BB_CON_LVDS/DSI_CLK_P: U16.11(D2–) ; port BB_CON_LVDS/DSI.BB_CON_LVDS/DSI_CLK_P
BB_CON_LVDS/DSI_D0_N: U16.5(D0+) ; port BB_CON_LVDS/DSI.BB_CON_LVDS/DSI_D0_N
BB_CON_LVDS/DSI_D0_P: U16.6(D0–) ; port BB_CON_LVDS/DSI.BB_CON_LVDS/DSI_D0_P
BB_CON_LVDS/DSI_D1_N: U16.7(D1+) ; port BB_CON_LVDS/DSI.BB_CON_LVDS/DSI_D1_N
BB_CON_LVDS/DSI_D1_P: U16.8(D1–) ; port BB_CON_LVDS/DSI.BB_CON_LVDS/DSI_D1_P
BB_CON_LVDS/DSI_D2_N: U16.12(D3+) ; port BB_CON_LVDS/DSI.BB_CON_LVDS/DSI_D2_N
BB_CON_LVDS/DSI_D2_P: U16.13(D3–) ; port BB_CON_LVDS/DSI.BB_CON_LVDS/DSI_D2_P
BB_CON_LVDS/DSI_D3_N: U16.15(CEC) ; port BB_CON_LVDS/DSI.BB_CON_LVDS/DSI_D3_N
BB_CON_LVDS/DSI_D3_P: U16.14(HPD) ; port BB_CON_LVDS/DSI.BB_CON_LVDS/DSI_D3_P
BB_CON_PCIE_CLK_N: R147.1 ; port BB_CON_PCIe.BB_CON_PCIE_CLK_N
BB_CON_PCIE_CLK_P: R146.1 ; port BB_CON_PCIe.BB_CON_PCIE_CLK_P
BB_CON_PCIE_RX_N: R143.1 ; port BB_CON_PCIe.BB_CON_PCIE_RX_N
BB_CON_PCIE_RX_P: R142.1 ; port BB_CON_PCIe.BB_CON_PCIE_RX_P
BB_CON_PCIEC_TX_N: R145.1 ; port BB_CON_PCIe.BB_CON_PCIEC_TX_N
BB_CON_PCIEC_TX_P: R144.1 ; port BB_CON_PCIe.BB_CON_PCIEC_TX_P
DSI1_CLK_N: U16.34(D2+A) ; port DSI1.DSI1_CLK_N
DSI1_CLK_P: U16.33(D2–A) ; port DSI1.DSI1_CLK_P
DSI1_D0_N: U16.38(D0+A) ; port DSI1.DSI1_D0_N
DSI1_D0_P: U16.37(D0–A) ; port DSI1.DSI1_D0_P
DSI1_D1_N: U16.36(D1+A) ; port DSI1.DSI1_D1_N
DSI1_D1_P: U16.35(D1-A) ; port DSI1.DSI1_D1_P
DSI1_D2_N: U16.32(D3+A) ; port DSI1.DSI1_D2_N
DSI1_D2_P: U16.31(D3–A) ; port DSI1.DSI1_D2_P
DSI1_D3_N: U16.18(CEC_A) ; port DSI1.DSI1_D3_N
DSI1_D3_P: U16.19(HPD_A) ; port DSI1.DSI1_D3_P
LVDS0_CLK_N: U16.25(D2+B) ; port LVDS0.LVDS0_CLK_N
LVDS0_CLK_P: U16.24(D2–B) ; port LVDS0.LVDS0_CLK_P
LVDS0_TX0_N: U16.29(D0+B) ; port LVDS0.LVDS0_TX0_N
LVDS0_TX0_P: U16.28(D0–B) ; port LVDS0.LVDS0_TX0_P
LVDS0_TX1_N: U16.27(D1+B) ; port LVDS0.LVDS0_TX1_N
LVDS0_TX1_P: U16.26(D1–B) ; port LVDS0.LVDS0_TX1_P
LVDS0_TX2_N: U16.23(D3+B) ; port LVDS0.LVDS0_TX2_N
LVDS0_TX2_P: U16.22(D3–B) ; port LVDS0.LVDS0_TX2_P
LVDS0_TX3_N: U16.20(CEC_B) ; port LVDS0.LVDS0_TX3_N
LVDS0_TX3_P: U16.21(HPD_B) ; port LVDS0.LVDS0_TX3_P
LVDS/DSI_SEL: R148.2 TP94.TP U16.17(SEL2) ; port LVDS/DSI_SEL
PCIE_CLK_N: R141.1 R147.2 ; port PCIe.PCIE_CLK_N
PCIE_CLK_P: R140.1 R146.2 ; port PCIe.PCIE_CLK_P
PCIE_RX_N: R137.1 R143.2 ; port PCIe.PCIE_RX_N
PCIE_RX_P: R136.1 R142.2 ; port PCIe.PCIE_RX_P
PCIEC_TX_N: R139.1 R145.2 ; port PCIe.PCIEC_TX_N
PCIEC_TX_P: R138.1 R144.2 ; port PCIe.PCIEC_TX_P
SCI_I2C_SCL: R149.2 U17.10(I2C_SCL) ; port SCI_I2C_SCL
SCI_I2C_SDA: R150.2 U17.9(I2C_SDA) ; port SCI_I2C_SDA
SCO_I2C_SCL: R149.1 U17.16(ISO_7816_IO2) ; port SCO_I2C_SCL  [project net CON_SCL0]
SCO_I2C_SDA: R150.1 U17.3(ISO_7816_IO1) ; port SCO_I2C_SDA  [project net CON_SDA0]
TPU_PCIe_CLK_N: R141.2 ; port TPU_PCIe.TPU_PCIe_CLK_N
TPU_PCIe_CLK_P: R140.2 ; port TPU_PCIe.TPU_PCIe_CLK_P
TPU_PCIe_RX_N: R139.2 ; port TPU_PCIe.TPU_PCIe_RX_N
TPU_PCIe_RX_P: R138.2 ; port TPU_PCIe.TPU_PCIe_RX_P
TPU_PCIe_TX_N: R137.2 ; port TPU_PCIe.TPU_PCIe_TX_N
TPU_PCIe_TX_P: R136.2 ; port TPU_PCIe.TPU_PCIe_TX_P
NetC193_1: C193.1 L12.2 TP95.TP U17.11(ENA) U17.18(VCC)
NetC194_1: C194.1 L11.2 TP96.TP U17.12(VIN)
NetL13_2: L13.2 U17.19(VSS)
NetTP92_TP: TP92.TP U17.1(ISO_14443_LB)
NetTP93_TP: TP93.TP U17.17(ISO_14443_LA)

Not connected (* = marked no-connect by the designer): U16 3(SCL) 4(SDA) 9(NC) 30(NC) 39(SDA_B) 40(SCL_B) 41(SDA_A) 42(SCL_A); U17 2(NC) 4(NC) 5(NC) 6(NC) 7(NC) 8(NC) 13(ISO_7816_CLK) 14(ISO_7816_RST_N) 15(VOUT) 20(NC)

### Layout directives
net class PCIe: (no net found under the mark)
net class TPU_PCIe: (no net found under the mark)
net class BB_CON_PCIe: (no net found under the mark)
net class BB_CON_LVDS/DSI: (no net found under the mark)
net class DSI1: (no net found under the mark)
net class LVDS0: (no net found under the mark)
net class PWR: NetC193_1, NetC194_1

### Notes on the sheet
- Configuration and Assembly Options
- PCIe_TPU_TX
- Coral Edge TPU
- PCIe_TPU_RX
- PCIe routing
- PCIe_ROOT_RX
- i.MX 8M Plus internally generates 100MHz reference clock. The internal clock source exhibits a large jitter which is outside of the Gen3 specification. An external precision clock source is recommended. Testing has shown that Gen3 link speeds can be achieved without using a dedicated 100MHz reference clock source. Further validation needed.
- PCIe_ROOT_TX
- (near R136) DNP
- DNP
- (near R138) DNP
- (near R140) DNP
- PCIe Assembly Option:
  PCIe Interface can be routed either to the Coral Edge TPU or
  to the board-to-board connector. Routing is realized through
  0201 jumper resistors. Validate signal integrity based on PCB jumper geometry
- Board-to-Board Connector
- PCIe_CON_RX
- PCIe_CON_TX
- LVDS or DSI Selector
- EdgeLock Secure Element
- DSI Interface
- ISO14443 Antenna Connection
- (near R148) LVDS/DSI_SEL = 0 -> DSI selected
  LVDS/DSI_SEL = 1 -> LVDS selected
- LVDS/DSI
- LVDS Interface
- Signal Level Indication
- Border Color = 1.8V
- Border Color = 3.3V
- The TS3DV642 features 12 identical channels. Even if the naming convention suggests different electrical properties for SDA/SCL/CEC/HPD channels, this is not the case.
- Border Color = Don´t care
- LVDS and DSI DC offset voltage typically 1.125V - 1.375V
- Filter beads (3x) according to the manufacturer's recommendation. Function unclear, explanation missing. Optionally fitted, needs to be measured/analyzed.
- OV Tech GmbH - Open Visions Technology
- (in symbol CAP_0201_1uF_6.3V) X5R; 0201
- (in symbol CAP_0201_33nF_10V) 0201; X7R
- (in symbol High Speed MUX 12x1:2_TS3DV642A0RUAR) PORT A; 12x; COM; PORT B
- (in symbol RES_0201_0R_1%) 0201
- (in symbol RES_0201_10k_1%) 0201

### Library data of the parts
?#13 = Titleblock_01_OpenSource
C192 = CAP_0201_1uF_6.3V: as C167 on sheet 11_WIFI_BLE_Module; Manufacturer 2: Samsung Electro-Mechanics
C193 C194 = CAP_0201_33nF_10V: Multilayer Ceramic Capacitors MLCC - SMD/SMT 0201 10VDC; Manufacturer 1: Murata Electronics; Manufacturer 1 Prt. Nr.: GRM033R61A333KE84E; Manufacturer 2 Prt. Nr.: CC0201KRX5R6BB333; Manufacturer 2: YAGEO
L11-L13 = BEAD_0201_330Ohm_305mA: Ferrite Bead 0201 330Ohm 305mA; Manufacturer 1 Prt. Nr.: NFZ03SG331SN10D; Manufacturer 1: Murata Electronics
R136-R147 R149 R150 = RES_0201_0R_1%: as R123-R125 on sheet 11_WIFI_BLE_Module; Manufacturer 2: Vishay / Dale
R148 = RES_0201_10k_1%: as R107-R111 on sheet 11_WIFI_BLE_Module; Manufacturer 2: Vishay / Dale
U16 = High Speed MUX 12x1:2_TS3DV642A0RUAR: High-speed differential switch 12x2:1 for TMDS and generel LVDS signal switching; Manufacturer 1: Texas Instruments; Manufacturer 1 Prt. Nr.: TS3DV642A0RUAR
U17 = Secure Element I2C_SE051: Secure Element Plug & Trust SE051; Manufacturer 1: NXP Semiconductors; Manufacturer 1 Prt. Nr.: SE051C2HQ1/Z01XDZ

## Sheet 14_BTB_Connector_P1-P100.SchDoc: Board to Board Connector A
size 420 x 297 mm; Author: Lukas Henkel; DocumentNumber: 14; SheetNumber: 14; SheetTotal: 16; DocSize: A3
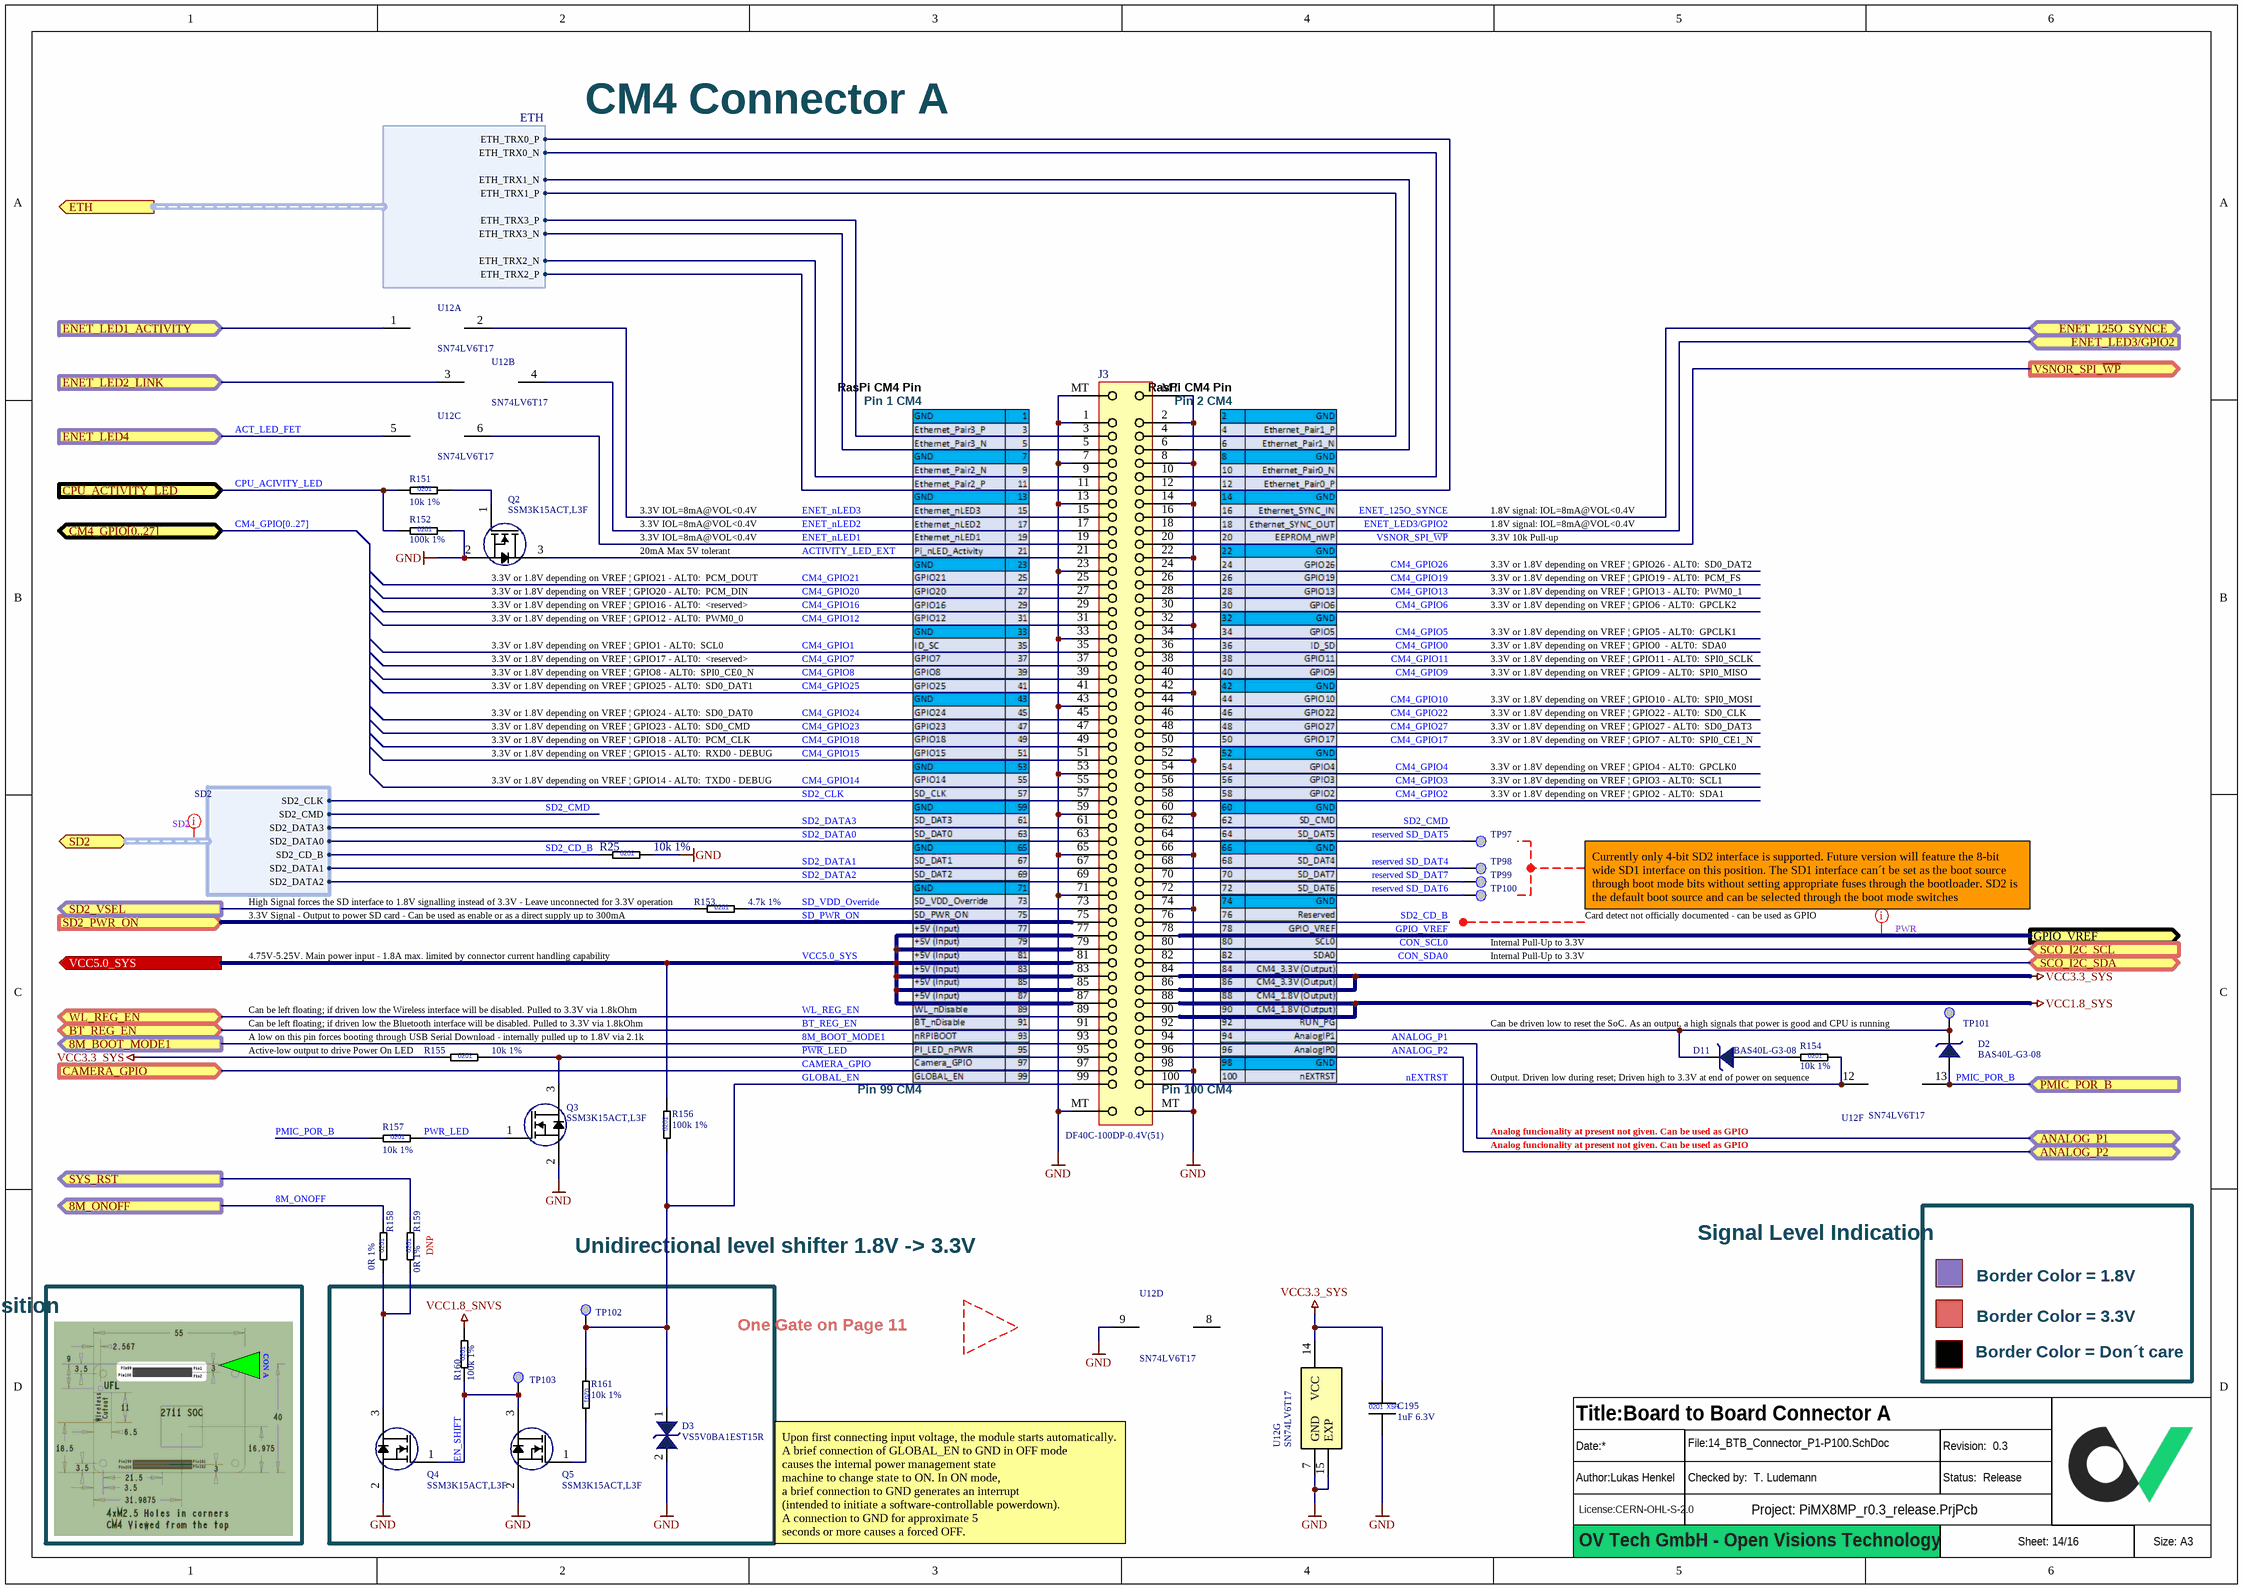
[diagram p14: 14_BTB_Connector_P1-P100.SchDoc]

### Parts
(Parts that share a designator on the sheet are numbered #1, #2 ... from top to bottom, then left to right.)
?#14  (no value)  (graphical)
C195  1uF 6.3V  [CAPC0603X03L]
D2  BAS40L-G3-08  [DFN1006-2A]
D3  VS5V0BA1EST15R  [DFN38P60X29-2L]
D11  BAS40L-G3-08  [DFN1006-2A]
J3  DF40C-100DP-0.4V(51)  [BOARD-TO-BOARD DF40C-100DP-0.4V]
Q2  SSM3K15ACT,L3F  [DFN65P100X50-3L]
Q3  SSM3K15ACT,L3F  [DFN65P100X50-3L]
Q4  SSM3K15ACT,L3F  [DFN65P100X50-3L]
Q5  SSM3K15ACT,L3F  [DFN65P100X50-3L]
R25  10k 1%  [RESC0603X03L]
R151  10k 1%  [RESC0603X03L]
R152  100k 1%  [RESC0603X03L]
R153  4.7k 1%  [RESC0603X03L]
R154  10k 1%  [RESC0603X03L]
R155  10k 1%  [RESC0603X03L]
R156  100k 1%  [RESC0603X03L]
R157  10k 1%  [RESC0603X03L]
R158  0R 1%  [RESC0603X03L]
R159  0R 1%  [RESC0603X03L]
R160  100k 1%  [RESC0603X03L]
R161  10k 1%  [RESC0603X03L]
TP97  Testpoint 0.5mm  [TP_0.50mm]  (value not drawn)  (no BOM)
TP98  Testpoint 0.5mm  [TP_0.50mm]  (value not drawn)  (no BOM)
TP99  Testpoint 0.5mm  [TP_0.50mm]  (value not drawn)  (no BOM)
TP100  Testpoint 0.5mm  [TP_0.50mm]  (value not drawn)  (no BOM)
TP101  Testpoint 0.5mm  [TP_0.50mm]  (value not drawn)  (no BOM)
TP102  Testpoint 0.5mm  [TP_0.50mm]  (value not drawn)  (no BOM)
TP103  Testpoint 0.5mm  [TP_0.50mm]  (value not drawn)  (no BOM)
U12  SN74LV6T17  [QFN50P250X300X80_HS-13L]  (parts A,B,C,D,F,G of 7)

### Ports
8M_BOOT_MODE1 (out), 8M_ONOFF (out), ANALOG_P1 (bidir), ANALOG_P2 (bidir), BT_REG_EN (bidir), CAMERA_GPIO (in), CM4_GPIO[0..27] (bidir), CPU_ACTIVITY_LED (in), ENET_125O_SYNCE (bidir), ENET_LED1_ACTIVITY (in), ENET_LED2_LINK (in), ENET_LED3/GPIO2 (in), ENET_LED4 (in), ETH (out, harness ETH), GPIO_VREF (out), PMIC_POR_B (in), SCO_I2C_SCL (in), SCO_I2C_SDA (bidir), SD2 (bidir, harness SD2), SD2_PWR_ON (in), SD2_VSEL (out), SYS_RST (out), VCC5.0_SYS (out), VSNOR_SPI_~{WP} (out), WL_REG_EN (bidir)

### Harnesses
ETH: ETH_TRX0_P, ETH_TRX0_N, ETH_TRX1_N, ETH_TRX1_P, ETH_TRX2_P, ETH_TRX2_N, ETH_TRX3_P, ETH_TRX3_N
SD2: SD2_CLK, SD2_CMD, SD2_CD_B, SD2_DATA0, SD2_DATA1, SD2_DATA2, SD2_DATA3

### Nets
GND: C195.2 D3.2 J3.1 J3.2 J3.7 J3.8 J3.13 J3.14 J3.22 J3.23 J3.32 J3.33 J3.42 J3.43 J3.52 J3.53 J3.59 J3.60 J3.65 J3.66 J3.71 J3.74 J3.98 J3.MT Q2.2(S) Q3.2(S) Q4.2(S) Q5.2(S) R25.2 R152.2 U12.7(GND) U12.9(4A) U12.15(EXP)
VCC1.8_SNVS: R160.2
VCC1.8_SYS: J3.88 J3.90
VCC3.3_SYS: C195.1 J3.84 J3.86 R155.1 U12.14(VCC)
8M_BOOT_MODE1: J3.93 ; port 8M_BOOT_MODE1
8M_ONOFF: R158.2 ; port 8M_ONOFF
ACT_LED_FET: U12.5(3A) ; port ENET_LED4
ACTIVITY_LED_EXT: J3.21 Q2.3(D)
ANALOG_P1: J3.94 ; port ANALOG_P1
ANALOG_P2: J3.96 ; port ANALOG_P2
BT_REG_EN: J3.91 ; port BT_REG_EN
CAMERA_GPIO: J3.97 ; port CAMERA_GPIO
CM4_GPIO0: J3.36
CM4_GPIO1: J3.35
CM4_GPIO2: J3.58
CM4_GPIO3: J3.56
CM4_GPIO4: J3.54
CM4_GPIO5: J3.34
CM4_GPIO6: J3.30
CM4_GPIO7: J3.37
CM4_GPIO8: J3.39
CM4_GPIO9: J3.40
CM4_GPIO10: J3.44
CM4_GPIO11: J3.38
CM4_GPIO12: J3.31
CM4_GPIO13: J3.28
CM4_GPIO14: J3.55
CM4_GPIO15: J3.51
CM4_GPIO16: J3.29
CM4_GPIO17: J3.50
CM4_GPIO18: J3.49
CM4_GPIO19: J3.26
CM4_GPIO20: J3.27
CM4_GPIO21: J3.25
CM4_GPIO22: J3.46
CM4_GPIO23: J3.47
CM4_GPIO24: J3.45
CM4_GPIO25: J3.41
CM4_GPIO26: J3.24
CM4_GPIO27: J3.48
CON_SCL0: J3.80 ; port SCO_I2C_SCL
CON_SDA0: J3.82 ; port SCO_I2C_SDA
CPU_ACIVITY_LED: R151.1 R152.1 ; port CPU_ACTIVITY_LED
EN_SHIFT: Q4.1(G) Q5.3(D) R160.1 TP103.TP
ENET_125O_SYNCE: J3.16 ; port ENET_125O_SYNCE
ENET_LED1_ACTIVITY: U12.1(1A) ; port ENET_LED1_ACTIVITY
ENET_LED2_LINK: U12.3(2A) ; port ENET_LED2_LINK
ENET_LED3/GPIO2: J3.18 ; port ENET_LED3/GPIO2
ENET_nLED1: J3.19 U12.6(3Y)
ENET_nLED2: J3.17 U12.4(2Y)
ENET_nLED3: J3.15 U12.2(1Y)
ETH_TRX0_N: J3.10 ; port ETH.ETH_TRX0_N
ETH_TRX0_P: J3.12 ; port ETH.ETH_TRX0_P
ETH_TRX1_N: J3.6 ; port ETH.ETH_TRX1_N
ETH_TRX1_P: J3.4 ; port ETH.ETH_TRX1_P
ETH_TRX2_N: J3.9 ; port ETH.ETH_TRX2_N
ETH_TRX2_P: J3.11 ; port ETH.ETH_TRX2_P
ETH_TRX3_N: J3.5 ; port ETH.ETH_TRX3_N
ETH_TRX3_P: J3.3 ; port ETH.ETH_TRX3_P
GLOBAL_EN: D3.1 J3.99 R156.1 R161.1 TP102.TP
GPIO_VREF: J3.78 ; port GPIO_VREF
nEXTRST: J3.100 R154.2 U12.12(6Y)
~{PWR}_LED: J3.95 Q3.3(D) R155.2
PMIC_POR_B: D2.2 R157.1 U12.13(6A) ; port PMIC_POR_B
PWR_LED: Q3.1(G) R157.2
reserved SD_DAT4: J3.68 TP98.TP
reserved SD_DAT5: J3.64 TP97.TP
reserved SD_DAT6: J3.72 TP100.TP
reserved SD_DAT7: J3.70 TP99.TP
SD2_CD_B: J3.76 R25.1 ; port SD2.SD2_CD_B
SD2_CLK: J3.57 ; port SD2.SD2_CLK
SD2_CMD: J3.62 ; port SD2.SD2_CMD
SD2_DATA0: J3.63 ; port SD2.SD2_DATA0
SD2_DATA1: J3.67 ; port SD2.SD2_DATA1
SD2_DATA2: J3.69 ; port SD2.SD2_DATA2
SD2_DATA3: J3.61 ; port SD2.SD2_DATA3
SD2_VSEL: R153.1 ; port SD2_VSEL
SD_PWR_ON: J3.75 ; port SD2_PWR_ON
SD_VDD_Override: J3.73 R153.2
SYS_RST: R159.2 ; port SYS_RST
VCC5.0_SYS: J3.77 J3.79 J3.81 J3.83 J3.85 J3.87 R156.2 ; port VCC5.0_SYS
VSNOR_SPI_~{WP}: J3.20 ; port VSNOR_SPI_~{WP}
WL_REG_EN: J3.89 ; port WL_REG_EN
NetD2_1: D2.1 D11.1 J3.92 TP101.TP
NetD11_2: D11.2 R154.1
NetQ2_1: Q2.1(G) R151.2
NetQ4_3: Q4.3(D) R158.1 R159.1
NetQ5_1: Q5.1(G) R161.2

Not connected (* = marked no-connect by the designer): U12 8(4Y)

### Buses and harness runs
bus CM4_GPIO[0..27] = port CM4_GPIO[0..27]

### Layout directives
net class SD2: (no net found under the mark)
net class PWR: GPIO_VREF

### Notes on the sheet
- CM4 Connector A
- RasPi CM4 Pin
- Pin 1 CM4
- Pin 2 CM4
- 3.3V IOL=8mA@VOL<0.4V
- 1.8V signal: IOL=8mA@VOL<0.4V
- (near Q2) 3.3V or 1.8V depending on VREF | GPIO20 - ALT0:  PCM_DIN
- (near Q2) 3.3V or 1.8V depending on VREF | GPIO21 - ALT0:  PCM_DOUT
- 20mA Max 5V tolerant
- 3.3V 10k Pull-up
- 3.3V or 1.8V depending on VREF | GPIO13 - ALT0:  PWM0_1
- 3.3V or 1.8V depending on VREF | GPIO19 - ALT0:  PCM_FS
- 3.3V or 1.8V depending on VREF | GPIO26 - ALT0:  SD0_DAT2
- 3.3V or 1.8V depending on VREF | GPIO1 - ALT0:  SCL0
- 3.3V or 1.8V depending on VREF | GPIO12 - ALT0:  PWM0_0
- (near Q2) 3.3V or 1.8V depending on VREF | GPIO16 - ALT0:  <reserved>
- 3.3V or 1.8V depending on VREF | GPIO17 - ALT0:  <reserved>
- 3.3V or 1.8V depending on VREF | GPIO0  - ALT0:  SDA0
- 3.3V or 1.8V depending on VREF | GPIO5 - ALT0:  GPCLK1
- 3.3V or 1.8V depending on VREF | GPIO6 - ALT0:  GPCLK2
- 3.3V or 1.8V depending on VREF | GPIO11 - ALT0:  SPI0_SCLK
- 3.3V or 1.8V depending on VREF | GPIO8 - ALT0:  SPI0_CE0_N
- 3.3V or 1.8V depending on VREF | GPIO23 - ALT0:  SD0_CMD
- 3.3V or 1.8V depending on VREF | GPIO24 - ALT0:  SD0_DAT0
- 3.3V or 1.8V depending on VREF | GPIO25 - ALT0:  SD0_DAT1
- 3.3V or 1.8V depending on VREF | GPIO9 - ALT0:  SPI0_MISO
- 3.3V or 1.8V depending on VREF | GPIO10 - ALT0:  SPI0_MOSI
- 3.3V or 1.8V depending on VREF | GPIO22 - ALT0:  SD0_CLK
- 3.3V or 1.8V depending on VREF | GPIO27 - ALT0:  SD0_DAT3
- 3.3V or 1.8V depending on VREF | GPIO14 - ALT0:  TXD0 - DEBUG
- 3.3V or 1.8V depending on VREF | GPIO15 - ALT0:  RXD0 - DEBUG
- 3.3V or 1.8V depending on VREF | GPIO18 - ALT0:  PCM_CLK
- (near TP97) 3.3V or 1.8V depending on VREF | GPIO2 - ALT0:  SDA1
- 3.3V or 1.8V depending on VREF | GPIO3 - ALT0:  SCL1
- 3.3V or 1.8V depending on VREF | GPIO4 - ALT0:  GPCLK0
- 3.3V or 1.8V depending on VREF | GPIO7 - ALT0:  SPI0_CE1_N
- (near R153) 3.3V Signal - Output to power SD card - Can be used as enable or as a direct supply up to 300mA
- (near R153) High Signal forces the SD interface to 1.8V signalling instead of 3.3V - Leave unconnected for 3.3V operation
- Card detect not officially documented - can be used as GPIO
- Currently only 4-bit SD2 interface is supported. Future version will feature the 8-bit wide SD1 interface on this position. The SD1 interface can´t be set as the boot source through boot mode bits without setting appropriate fuses through the bootloader. SD2 is the default boot source and can be selected through the boot mode switches
- (near R153) 4.75V-5.25V. Main power input - 1.8A max. limited by connector current handling capability
- Internal Pull-Up to 3.3V
- (near R155) Can be left floating; if driven low the Wireless interface will be disabled. Pulled to 3.3V via 1.8kOhm
- (near R155) Can be left floating; if driven low the Bluetooth interface will be disabled. Pulled to 3.3V via 1.8kOhm
- (near R155) A low on this pin forces booting through USB Serial Download - internally pulled up to 1.8V via 2.1k
- (near R155) Active-low output to drive Power On LED
- (near TP101) Can be driven low to reset the SoC. As an output, a high signals that power is good and CPU is running
- Pin 99 CM4
- Pin 100 CM4
- (near U12) Output. Driven low during reset; Driven high to 3.3V at end of power on sequence
- Analog funcionality at present not given. Can be used as GPIO
- (near R159) DNP
- Unidirectional level shifter 1.8V -> 3.3V
- Signal Level Indication
- CM4 Connector Position
- One Gate on Page 11
- Border Color = 1.8V
- Border Color = 3.3V
- CON A
- Border Color = Don´t care
- Upon first connecting input voltage, the module starts automatically.
  A brief connection of GLOBAL_EN to GND in OFF mode
  causes the internal power management state
  machine to change state to ON. In ON mode,
  a brief connection to GND generates an interrupt
  (intended to initiate a software-controllable powerdown).
  A connection to GND for approximate 5
  seconds or more causes a forced OFF.
- OV Tech GmbH - Open Visions Technology
- (in symbol CAP_0201_1uF_6.3V) 0201; X5R
- (in symbol RES_0201_0R_1%) 0201
- (in symbol RES_0201_4.7k_1%) 0201
- (in symbol RES_0201_10k_1%) 0201
- (in symbol RES_0201_100k_1%) 0201

### Library data of the parts
?#14 = Titleblock_01_OpenSource
C195 = CAP_0201_1uF_6.3V: as C167 on sheet 11_WIFI_BLE_Module; Manufacturer 2: Samsung Electro-Mechanics
D2 D11 = Schottky 40V_200mA_BAS40L-G3-08: Schottky Diodes & Rectifiers; Manufacturer 1: Vishay; Manufacturer 1 Prt. Nr.: BAS40L-G3-08
D3 = ESD Protection Diode_5V_VS5V0BA1EST15R: ESD Diode Suppressors Bidirectional 5V working voltage 0201; Manufacturer 1: ROHM Semiconductor; Manufacturer 1 Prt. Nr.: VS5V0BA1EST15R
J3 = Board to Board Connector_DF40C-100DP-0.4V(51): Board to Board connector 100Pol Stacking Header 0.4mm Pitch; Manufacturer 1: Hirose Connector; Manufacturer 1 Prt. Nr.: DF40C-100DP-0.4V(51)
Q2-Q5 = N-Channel MOSFET_SSM3K15ACT,L3F: as Q1 on sheet 12_Coral_Edge_TPU; Manufacturer 1 Prt. Nr.: SSM3K15ACT,L3F
R25 R151 R154 R155 R157 R161 = RES_0201_10k_1%: as R107-R111 on sheet 11_WIFI_BLE_Module; Manufacturer 2: Vishay / Dale
R152 R156 R160 = RES_0201_100k_1%: as R132 on sheet 12_Coral_Edge_TPU; Manufacturer 2: Vishay / Dale
R153 = RES_0201_4.7k_1%: Thick Film Resistors - SMD 4.7K OHM 1%; Manufacturer 1: Yageo; Manufacturer 1 Prt. Nr.: RC0201JR-074K7P; Manufacturer 2 Prt. Nr.: CRCW02014K70FNED; Manufacturer 2: Vishay / Dale
R158 R159 = RES_0201_0R_1%: as R123-R125 on sheet 11_WIFI_BLE_Module; Manufacturer 2: Vishay / Dale
U12 = Hex_Schmitt-Buffer_LvL-Shift_SN74LV6T17: as U12 on sheet 11_WIFI_BLE_Module